# EAGLE design SolarCharger_RevE (EAGLE 7.6.0)

## Sheet 1 of 5
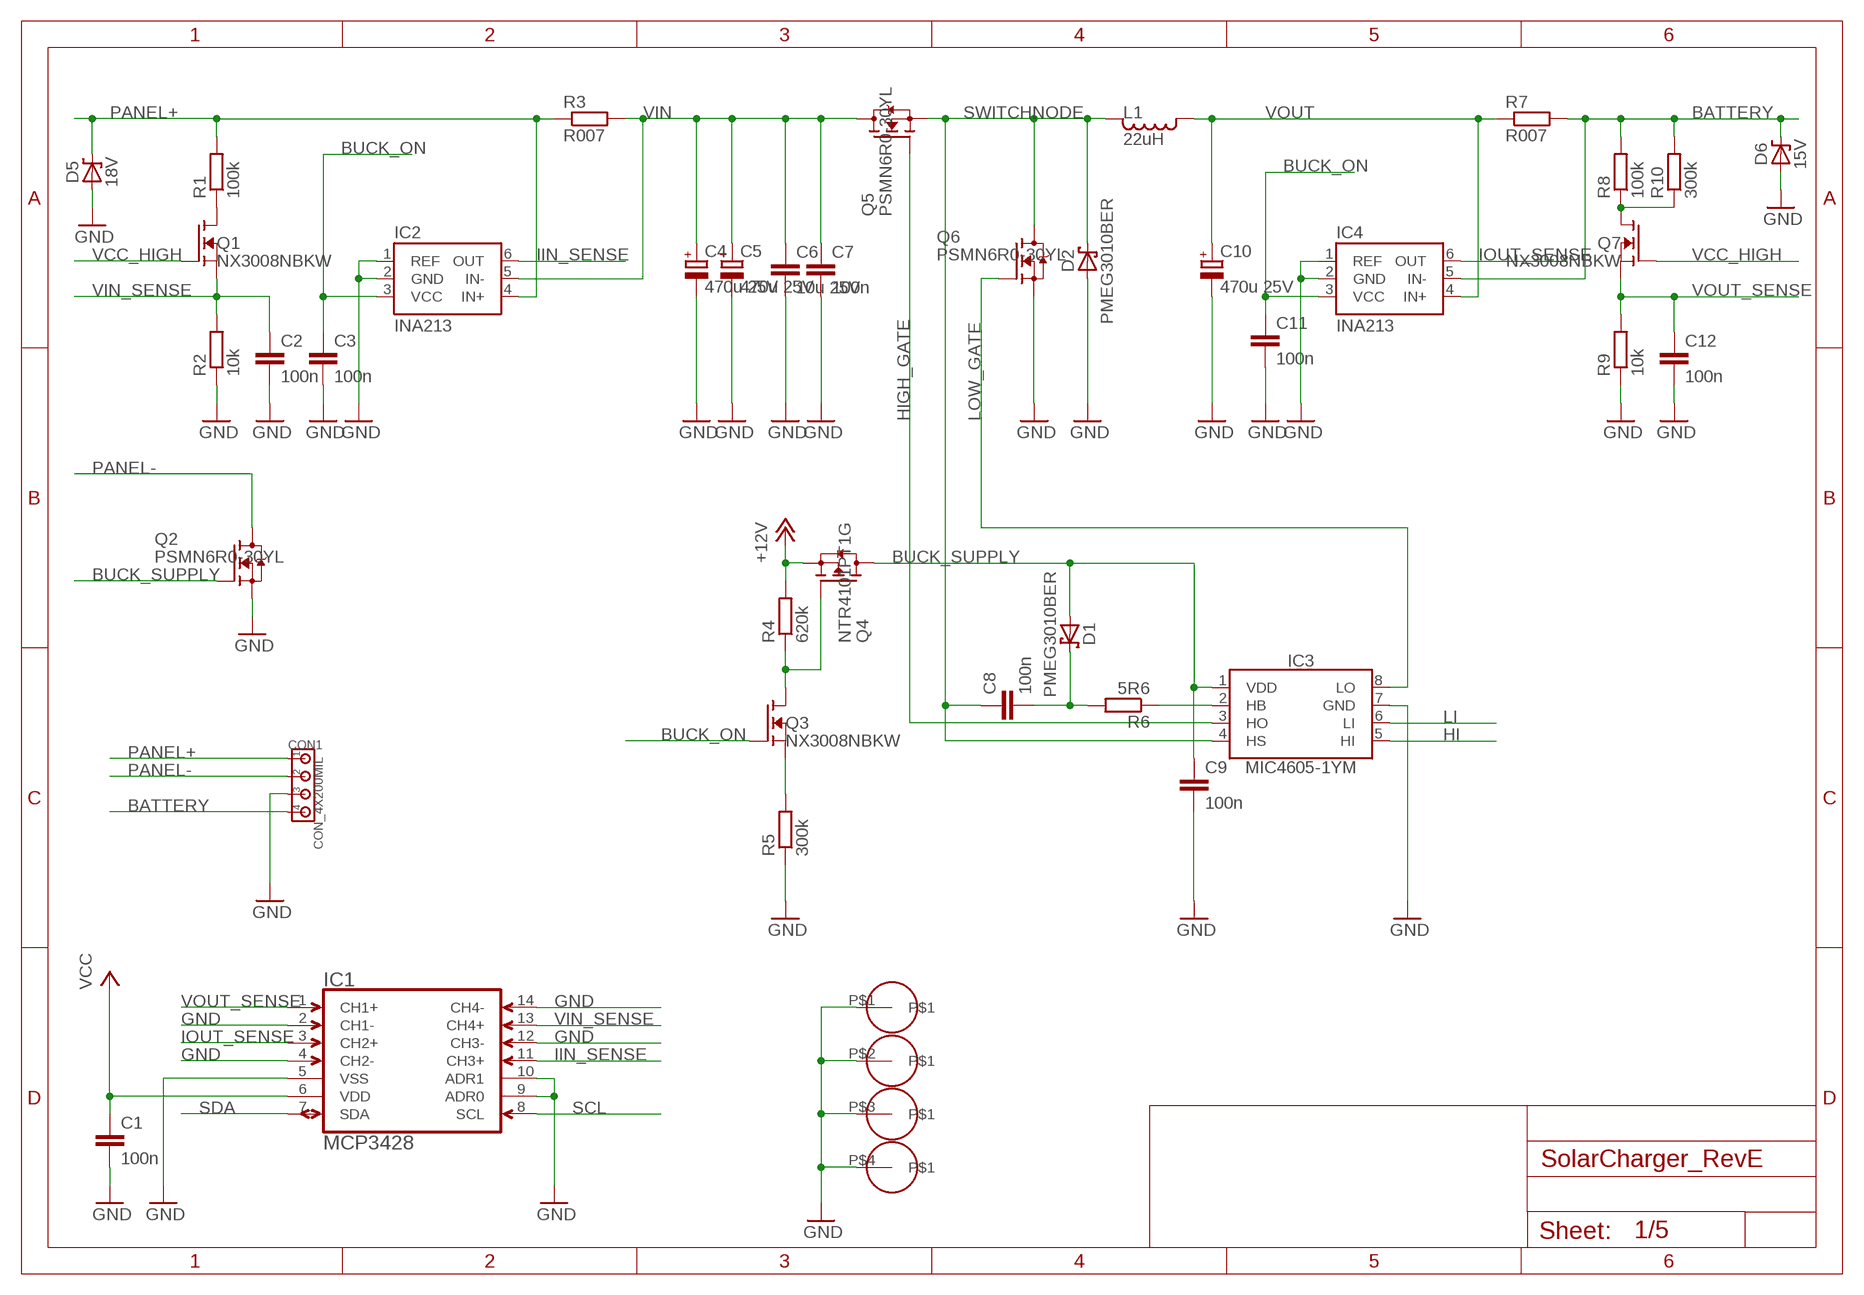
[diagram p0: schematic, sheet 1]

### Parts
C1  100n  CC0805  [C0805]
C2  100n  CC0805  [C0805]
C3  100n  CC0805  [C0805]
C4  470u 25V  C_POLARIZED10MM  [10MM]
C5  470u 25V  C_POLARIZED10MM  [10MM]
C6  10u 25V  CC1206  [C1206]
C7  100n  CC0805  [C0805]
C8  100n  CC0805  [C0805]
C9  100n  CC0805  [C0805]
C10  470u 25V  C_POLARIZED10MM  [10MM]
C11  100n  CC0805  [C0805]
C12  100n  CC0805  [C0805]
CON1  CON_4X200MIL  [200MIL_4X]
D1  PMEG3010BER  SCHOTTKYSOD123  [SOD123]
D2  PMEG3010BER  SCHOTTKYSOD123  [SOD123]
D5  18V  ZENERDO214  [DO214AC]
D6  15V  ZENERDO214  [DO214AC]
DRL1  PCB_115_90  [PCB_115_90]
IC1  MCP3428  [SO14]
IC2  INA213  INA21  [SC70-6]
IC3  MIC4605-1YM  MIC4605  [SOIC8]
IC4  INA213  INA21  [SC70-6]
L1  22uH  INDUCTORMSS1210  [MSS1210]
Q1  NX3008NBKW  N-FETSOT23  [SOT23]
Q2  PSMN6R0-30YL  N-PWR-MOSFETLFPAK  [LFPAK]
Q3  NX3008NBKW  N-FETSOT23  [SOT23]
Q4  NTR4101PT1G  P-FETSOT23  [SOT23]
Q5  PSMN6R0-30YL  N-PWR-MOSFETLFPAK  [LFPAK]
Q6  PSMN6R0-30YL  N-PWR-MOSFETLFPAK  [LFPAK]
Q7  NX3008NBKW  N-FETSOT23  [SOT23]
R1  100k  RESISTORR0805  [R0805]
R2  10k  RESISTORR0805  [R0805]
R3  R007  RESISTORR1206  [R1206]
R4  620k  RESISTORR0805  [R0805]
R5  300k  RESISTORR0805  [R0805]
R6  5R6  RESISTORR0805  [R0805]
R7  R007  RESISTORR1206  [R1206]
R8  100k  RESISTORR0805  [R0805]
R9  10k  RESISTORR0805  [R0805]
R10  300k  RESISTORR0805  [R0805]

### Nets
BATTERY [high_voltage]: CON1.4 D6.C IC4.5(IN-) R7.2 R8.2 R10.2 ; also sheet 2,4,5
BUCK_ON: C3.1 C11.1 IC2.3(VCC) IC4.3(VCC) Q3.1(G) ; also sheet 2
BUCK_SUPPLY [high_voltage]: C9.1 D1.A IC3.1(VDD) Q2.4(G) Q4.3(D)
GND: C1.2 C2.2 C3.2 C4.- C5.- C6.2 C7.2 C9.2 C10.- C11.2 C12.2 CON1.3 D2.A D5.A D6.A DRL1.P$1 DRL1.P$2 DRL1.P$3 DRL1.P$4 IC1.2(CH1-) IC1.4(CH2-) IC1.5(VSS) IC1.9(ADR0) IC1.10(ADR1) IC1.12(CH3-) IC1.14(CH4-) IC2.1(REF) IC2.2(GND) IC3.7(GND) IC4.1(REF) IC4.2(GND) Q2.1(S) Q2.2(S) Q2.3(S) Q6.1(S) Q6.2(S) Q6.3(S) R2.1 R5.1 R9.1 ; also sheet 2,3,4,5
HI: IC3.5(HI) ; also sheet 2
HIGH_GATE: IC3.3(HO) Q5.4(G)
IIN_SENSE: IC1.11(CH3+) IC2.6(OUT)
IOUT_SENSE: IC1.3(CH2+) IC4.6(OUT)
LI: IC3.6(LI) ; also sheet 2
LOW_GATE [high_voltage]: IC3.8(LO) Q6.4(G)
N$1: C8.2 D1.C R6.2
N$6: Q1.3(D) R1.1
N$8: IC3.2(HB) R6.1
N$16: Q3.3(D) Q4.1(G) R4.1
N$17: Q7.3(D) R8.1 R10.1
N$19: Q3.2(S) R5.2
PANEL+ [high_voltage]: CON1.1 D5.C IC2.4(IN+) R1.2 R3.1
PANEL-: CON1.2 Q2.MB1(D) Q2.MB2(D) Q2.MB3(D) Q2.VIA1(D) Q2.VIA2(D) Q2.VIA3(D) Q2.VIA4(D) Q2.VIA5(D) Q2.VIA6(D) Q2.VIA7(D) Q2.VIA8(D) Q2.VIA9(D)
SCL: IC1.8(SCL) ; also sheet 2,3
SDA: IC1.7(SDA) ; also sheet 2,3
SWITCHNODE [high_voltage]: C8.1 D2.C IC3.4(HS) L1.2 L1.2B L1.2C L1.2D L1.2E L1.2F L1.2G L1.2H Q5.1(S) Q5.2(S) Q5.3(S) Q6.MB1(D) Q6.MB2(D) Q6.MB3(D) Q6.VIA1(D) Q6.VIA2(D) Q6.VIA3(D) Q6.VIA4(D) Q6.VIA5(D) Q6.VIA6(D) Q6.VIA7(D) Q6.VIA8(D) Q6.VIA9(D)
VCC: C1.1 IC1.6(VDD) ; also sheet 2,3
VCC_HIGH: Q1.1(G) Q7.1(G) ; also sheet 2,3
VIN [high_voltage]: C4.+ C5.+ C6.1 C7.1 IC2.5(IN-) Q5.MB1(D) Q5.MB2(D) Q5.MB3(D) Q5.VIA1(D) Q5.VIA2(D) Q5.VIA3(D) Q5.VIA4(D) Q5.VIA5(D) Q5.VIA6(D) Q5.VIA7(D) Q5.VIA8(D) Q5.VIA9(D) R3.2
VIN_SENSE: C2.1 IC1.13(CH4+) Q1.2(S) R2.2
VOUT [high_voltage]: C10.+ IC4.4(IN+) L1.1 L1.1B L1.1C L1.1D L1.1E L1.1F L1.1G L1.1H Q4.2(S) R4.2 R7.1 ; supply symbol labelled +12V ; also sheet 3,5
VOUT_SENSE: C12.1 IC1.1(CH1+) Q7.2(S) R9.2

## Sheet 2 of 5
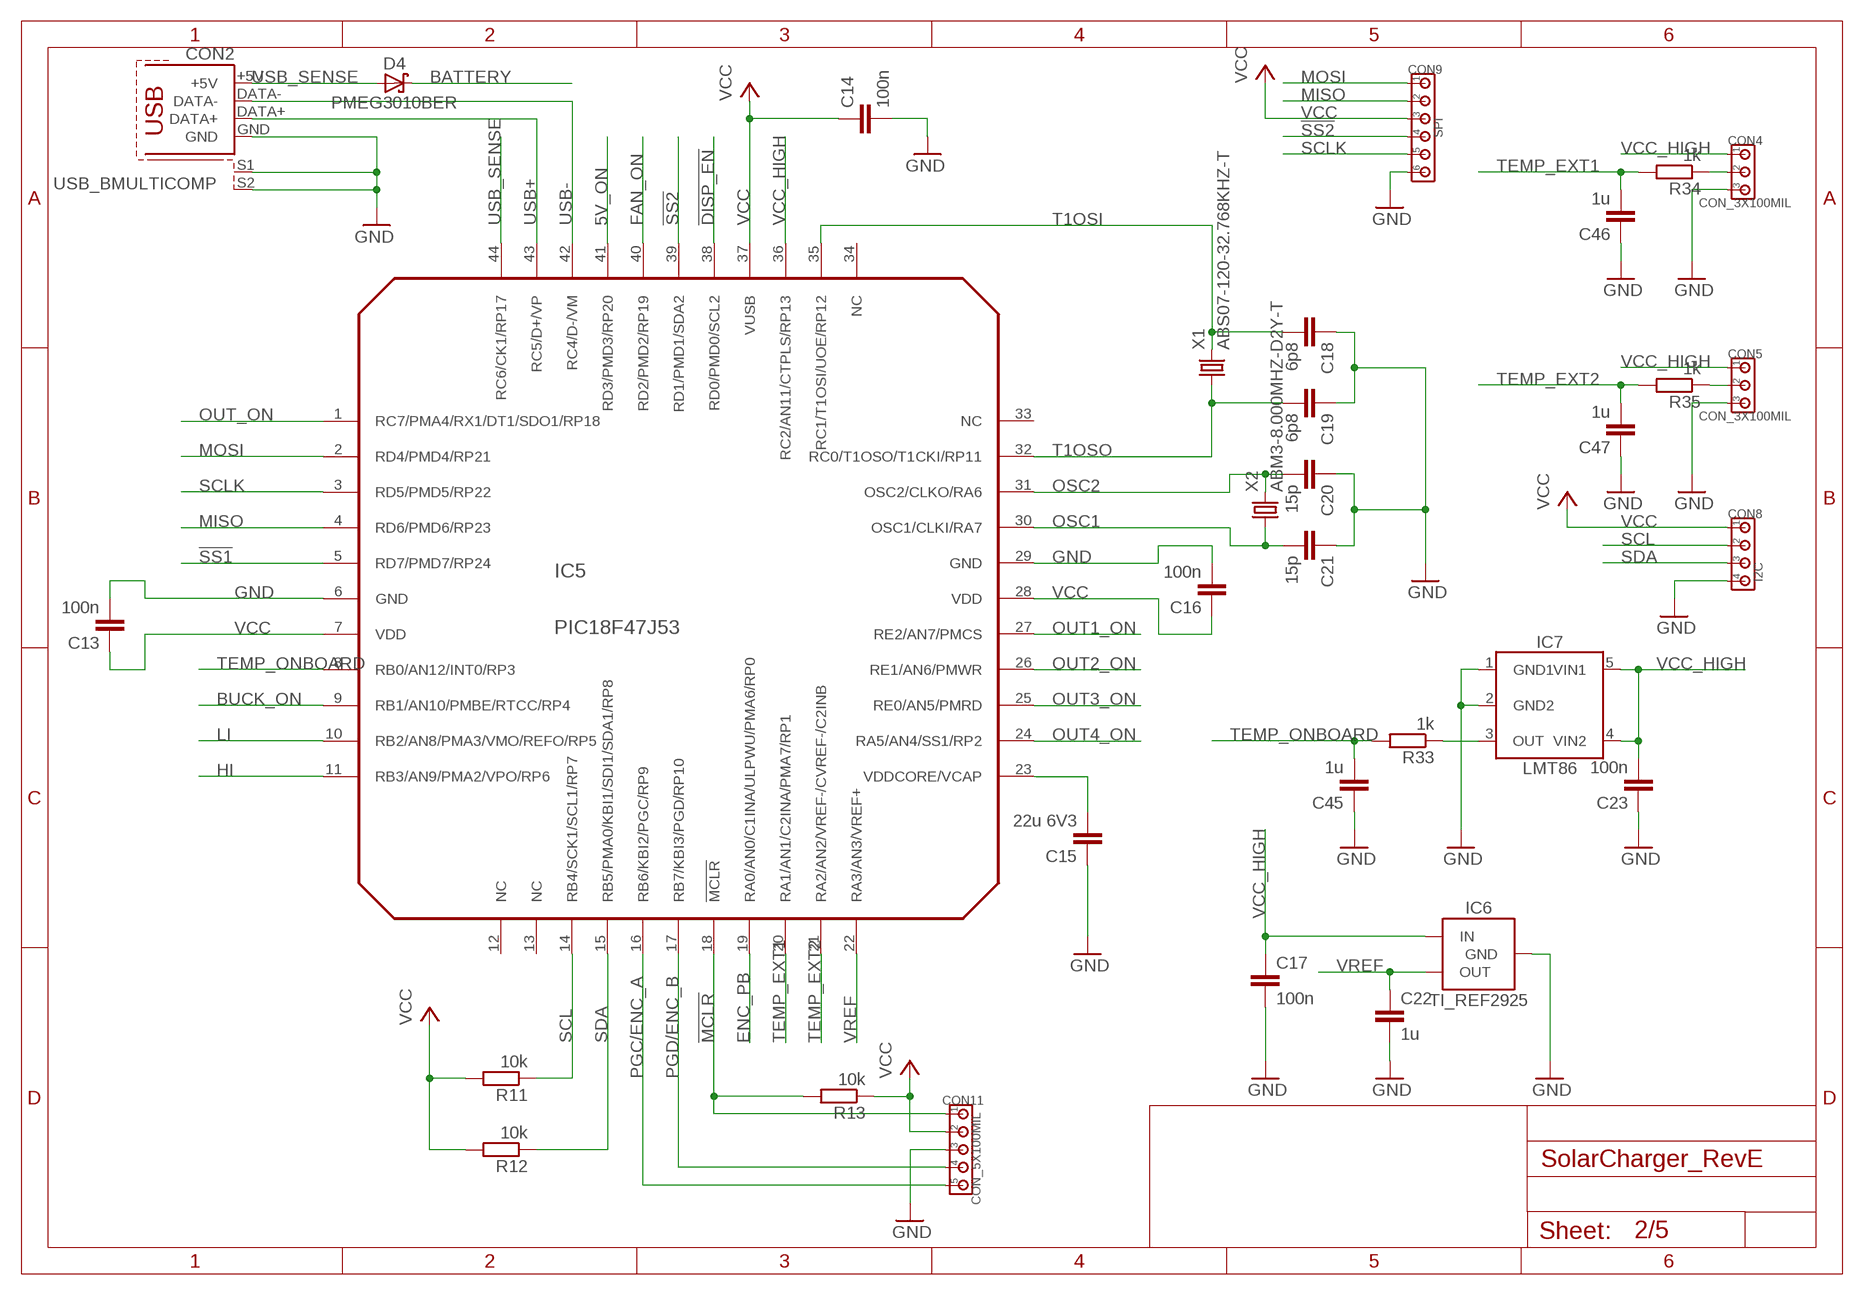
[diagram p1: schematic, sheet 2]

### Parts
C13  100n  CC0805  [C0805]
C14  100n  CC0805  [C0805]
C15  22u 6V3  CC1206  [C1206]
C16  100n  CC0805  [C0805]
C17  100n  CC0805  [C0805]
C18  6p8  CC0805  [C0805]
C19  6p8  CC0805  [C0805]
C20  15p  CC0805  [C0805]
C21  15p  CC0805  [C0805]
C22  1u  CC0805  [C0805]
C23  100n  CC0805  [C0805]
C45  1u  CC0805  [C0805]
C46  1u  CC0805  [C0805]
C47  1u  CC0805  [C0805]
CON2  USB_BMULTICOMP  [USB_B]
CON4  CON_3X100MIL  [100MIL_3X]
CON5  CON_3X100MIL  [100MIL_3X]
CON8  I2C  CON_4X100MIL  [100MIL_4X]
CON9  SPI  CON_6X3X2  [100MIL_3X2]
CON11  CON_5X100MIL  [100MIL_5X]
D4  PMEG3010BER  SCHOTTKYSOD123  [SOD123]
IC5  PIC18F47J53  PIC18F46J50  [TQFP44]
IC6  TI_REF2925  TS6001  [SOT23]
IC7  LMT86  [SC70-5]
R11  10k  RESISTORR0805  [R0805]
R12  10k  RESISTORR0805  [R0805]
R13  10k  RESISTORR0805  [R0805]
R33  1k  RESISTORR0805  [R0805]
R34  1k  RESISTORR0805  [R0805]
R35  1k  RESISTORR0805  [R0805]
X1  ABS07-120-32.768KHZ-T  CRYSTAL3.2X1.5  [3.2X1.5MM]
X2  ABM3-8.000MHZ-D2Y-T  CRYSTAL5X3.2MM  [5X3.2MM]

### Nets
5V_ON: IC5.41(RD3/PMD3/RP20) ; also sheet 4
!DISP_EN!: IC5.38(RD0/PMD0/SCL2) ; also sheet 3
!MCLR!: CON11.1 IC5.18(!MCLR!) R13.2
!SS1!: IC5.5(RD7/PMD7/RP24) ; also sheet 3
!SS2!: CON9.4 IC5.39(RD1/PMD1/SDA2)
BATTERY [high_voltage]: D4.C ; also sheet 1,4,5
BUCK_ON: IC5.9(RB1/AN10/PMBE/RTCC/RP4) ; also sheet 1
ENC_PB: IC5.19(RA0/AN0/C1INA/ULPWU/PMA6/RP0) ; also sheet 3
FAN_ON: IC5.40(RD2/PMD2/RP19) ; also sheet 5
GND: C13.2 C14.2 C15.1 C16.2 C17.2 C18.1 C19.1 C20.1 C21.1 C22.2 C23.1 C45.1 C46.1 C47.1 CON2.GND CON2.S1 CON2.S2 CON4.3 CON5.3 CON8.4 CON9.6 CON11.3 IC5.6(GND) IC5.29(GND) IC6.3(GND) IC7.1(GND1) IC7.2(GND2) ; also sheet 1,3,4,5
HI: IC5.11(RB3/AN9/PMA2/VPO/RP6) ; also sheet 1
LI: IC5.10(RB2/AN8/PMA3/VMO/REFO/RP5) ; also sheet 1
MISO: CON9.2 IC5.4(RD6/PMD6/RP23) ; also sheet 3
MOSI: CON9.1 IC5.2(RD4/PMD4/RP21) ; also sheet 3
N$2: C15.2 IC5.23(VDDCORE/VCAP)
N$4: IC7.3(OUT) R33.1
N$7: CON4.2 R34.1
N$14: CON5.2 R35.1
OSC1: C21.2 IC5.30(OSC1/CLKI/RA7) X2.1
OSC2: C20.2 IC5.31(OSC2/CLKO/RA6) X2.2
OUT1_ON: IC5.27(RE2/AN7/PMCS) ; also sheet 5
OUT2_ON: IC5.26(RE1/AN6/PMWR) ; also sheet 5
OUT3_ON: IC5.25(RE0/AN5/PMRD) ; also sheet 5
OUT4_ON: IC5.24(RA5/AN4/SS1/RP2) ; also sheet 5
OUT_ON: IC5.1(RC7/PMA4/RX1/DT1/SDO1/RP18) ; also sheet 5
PGC/ENC_A: CON11.5 IC5.16(RB6/KBI2/PGC/RP9) ; also sheet 3
PGD/ENC_B: CON11.4 IC5.17(RB7/KBI3/PGD/RP10) ; also sheet 3
SCL: CON8.2 IC5.14(RB4/SCK1/SCL1/RP7) R11.1 ; also sheet 1,3
SCLK: CON9.5 IC5.3(RD5/PMD5/RP22) ; also sheet 3
SDA: CON8.3 IC5.15(RB5/PMA0/KBI1/SDI1/SDA1/RP8) R12.1 ; also sheet 1,3
T1OSI: C18.2 IC5.35(RC1/T1OSI/UOE/RP12) X1.2
T1OSO: C19.2 IC5.32(RC0/T1OSO/T1CKI/RP11) X1.1
TEMP_EXT1: C46.2 IC5.20(RA1/AN1/C2INA/PMA7/RP1) R34.2
TEMP_EXT2: C47.2 IC5.21(RA2/AN2/VREF-/CVREF-/C2INB) R35.2
TEMP_ONBOARD: C45.2 IC5.8(RB0/AN12/INT0/RP3) R33.2
USB+: CON2.DATA+ IC5.43(RC5/D+/VP)
USB-: CON2.DATA- IC5.42(RC4/D-/VM)
USB_SENSE: CON2.+5V D4.A IC5.44(RC6/CK1/RP17)
VCC: C13.1 C14.1 C16.1 CON8.1 CON9.3 CON11.2 IC5.7(VDD) IC5.28(VDD) IC5.37(VUSB) R11.2 R12.2 R13.1 ; also sheet 1,3
VCC_HIGH: C17.1 C23.2 CON4.1 CON5.1 IC5.36(RC2/AN11/CTPLS/RP13) IC6.1(IN) IC7.4(VIN2) IC7.5(VIN1) ; also sheet 1,3
VREF: C22.1 IC5.22(RA3/AN3/VREF+) IC6.2(OUT)
Unconnected: IC5.12(NC) IC5.13(NC) IC5.33(NC) IC5.34(NC)

## Sheet 3 of 5
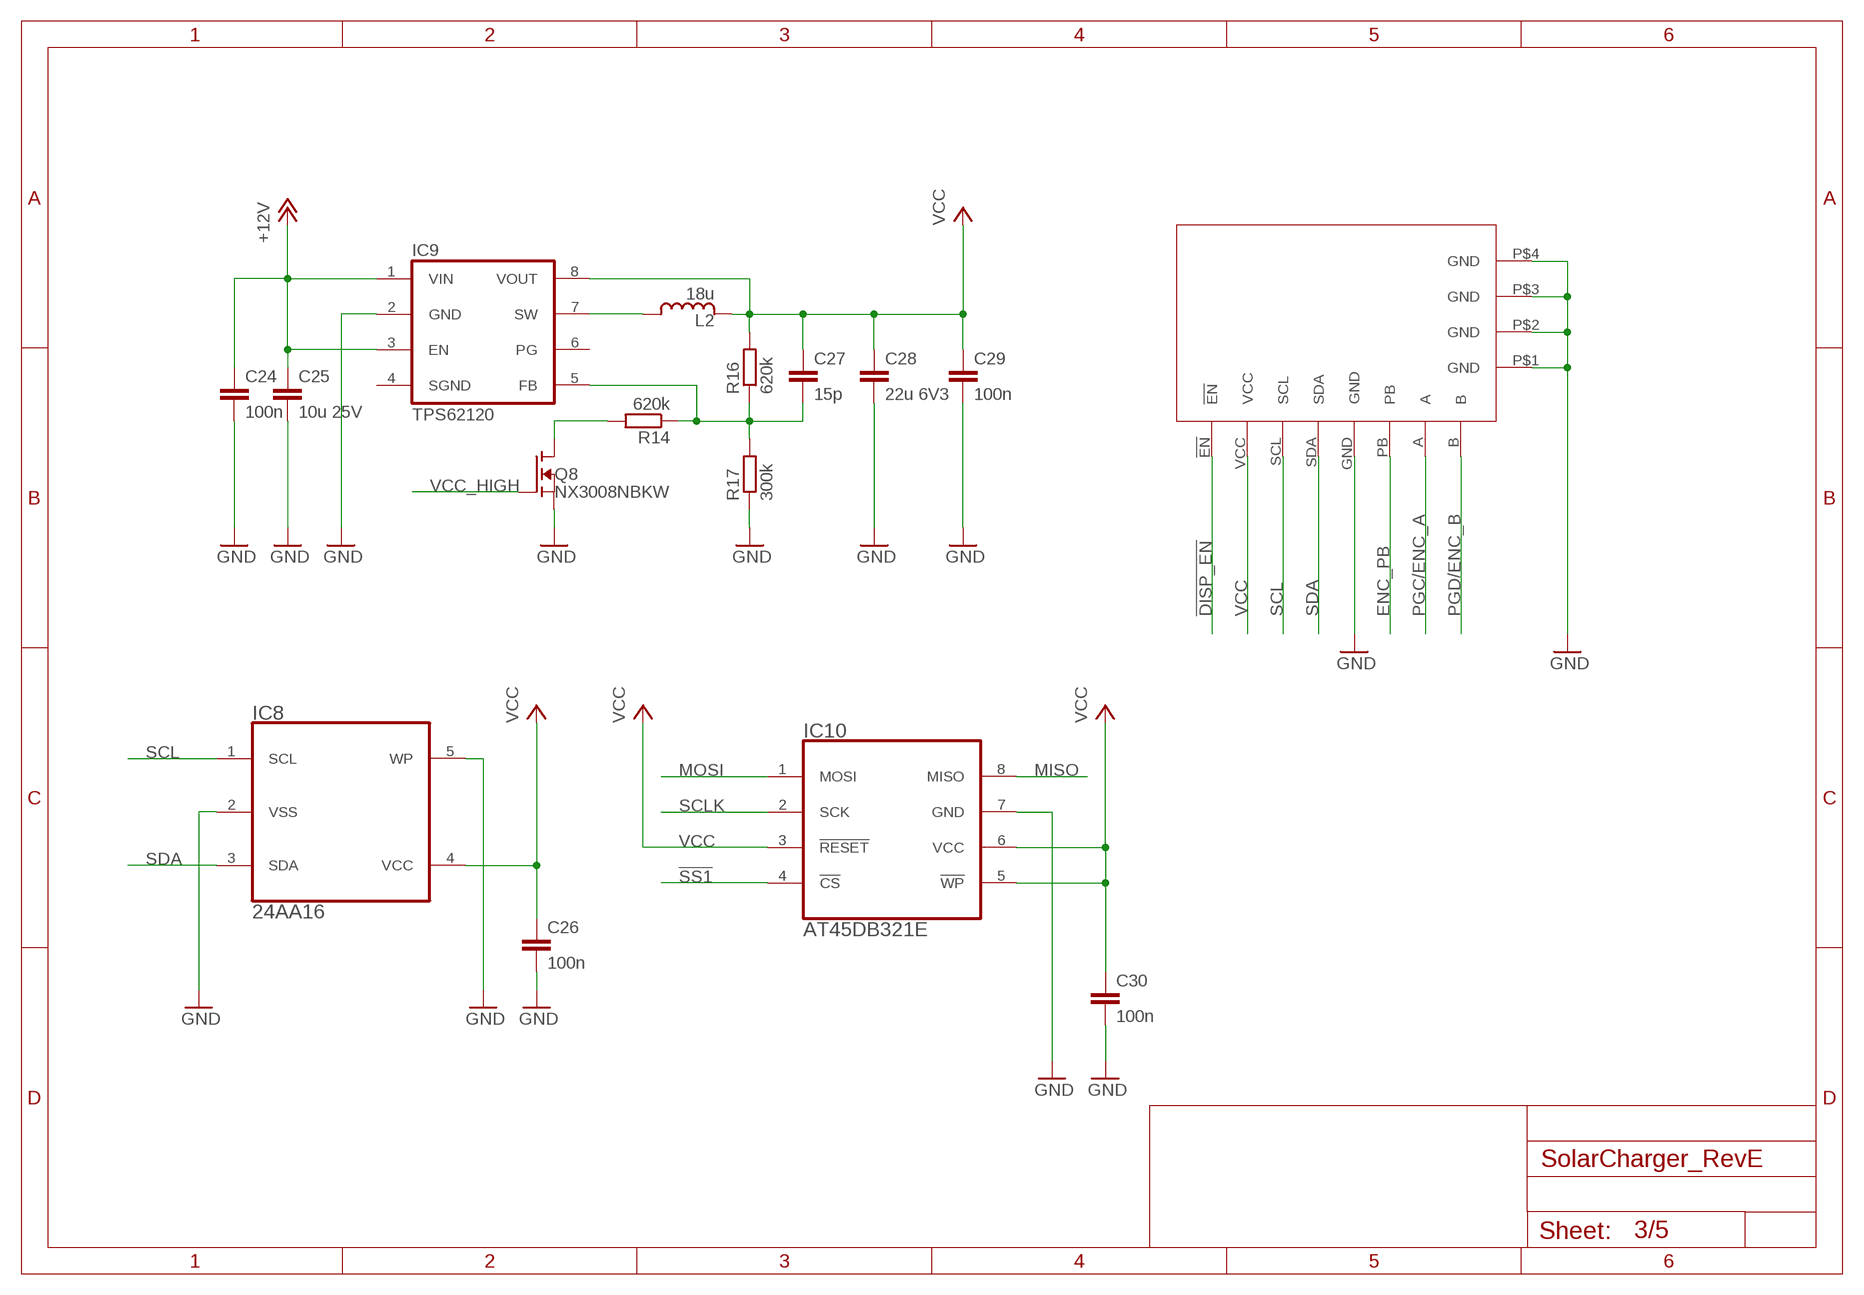
[diagram p2: schematic, sheet 3]

### Parts
BRD1  DISPLAY_UNIT  [DISPLAY_UNIT]
C24  100n  CC0805  [C0805]
C25  10u 25V  CC1206  [C1206]
C26  100n  CC0805  [C0805]
C27  15p  CC0805  [C0805]
C28  22u 6V3  CC1206  [C1206]
C29  100n  CC0805  [C0805]
C30  100n  CC0805  [C0805]
IC8  24AA16  [SOT-23-5]
IC9  TPS62120  [SOT-23-8]
IC10  AT45DB321E  AT45DB161EEIAJ  [EIAJ_SOIC8]
L2  18u  INDUCTORLPS3015  [LPS3015]
Q8  NX3008NBKW  N-FETSOT23  [SOT23]
R14  620k  RESISTORR0805  [R0805]
R16  620k  RESISTORR0805  [R0805]
R17  300k  RESISTORR0805  [R0805]

### Nets
!DISP_EN!: BRD1.!EN! ; also sheet 2
!SS1!: IC10.4(!CS!) ; also sheet 2
ENC_PB: BRD1.PB ; also sheet 2
GND: BRD1.GND BRD1.P$1(GND) BRD1.P$2(GND) BRD1.P$3(GND) BRD1.P$4(GND) C24.2 C25.2 C26.2 C28.2 C29.2 C30.2 IC8.2(VSS) IC8.5(WP) IC9.2(GND) IC10.7(GND) Q8.2(S) R17.1 ; also sheet 1,2,4,5
MISO: IC10.8(MISO) ; also sheet 2
MOSI: IC10.1(MOSI) ; also sheet 2
N$5: Q8.3(D) R14.2
N$9: IC9.7(SW) L2.1 L2.1B L2.1C L2.1D L2.1E
N$11: C27.2 IC9.5(FB) R14.1 R16.1 R17.2
PGC/ENC_A: BRD1.A ; also sheet 2
PGD/ENC_B: BRD1.B ; also sheet 2
SCL: BRD1.SCL IC8.1(SCL) ; also sheet 1,2
SCLK: IC10.2(SCK) ; also sheet 2
SDA: BRD1.SDA IC8.3(SDA) ; also sheet 1,2
VCC: BRD1.VCC C26.1 C27.1 C28.1 C29.1 C30.1 IC8.4(VCC) IC9.8(VOUT) IC10.3(!RESET!) IC10.5(!WP!) IC10.6(VCC) L2.2 L2.2B L2.2C L2.2D L2.2E R16.2 ; also sheet 1,2
VCC_HIGH: Q8.1(G) ; also sheet 1,2
VOUT [high_voltage]: C24.1 C25.1 IC9.1(VIN) IC9.3(EN) ; supply symbol labelled +12V ; also sheet 1,5
Unconnected: IC9.4(SGND) IC9.6(PG)

## Sheet 4 of 5
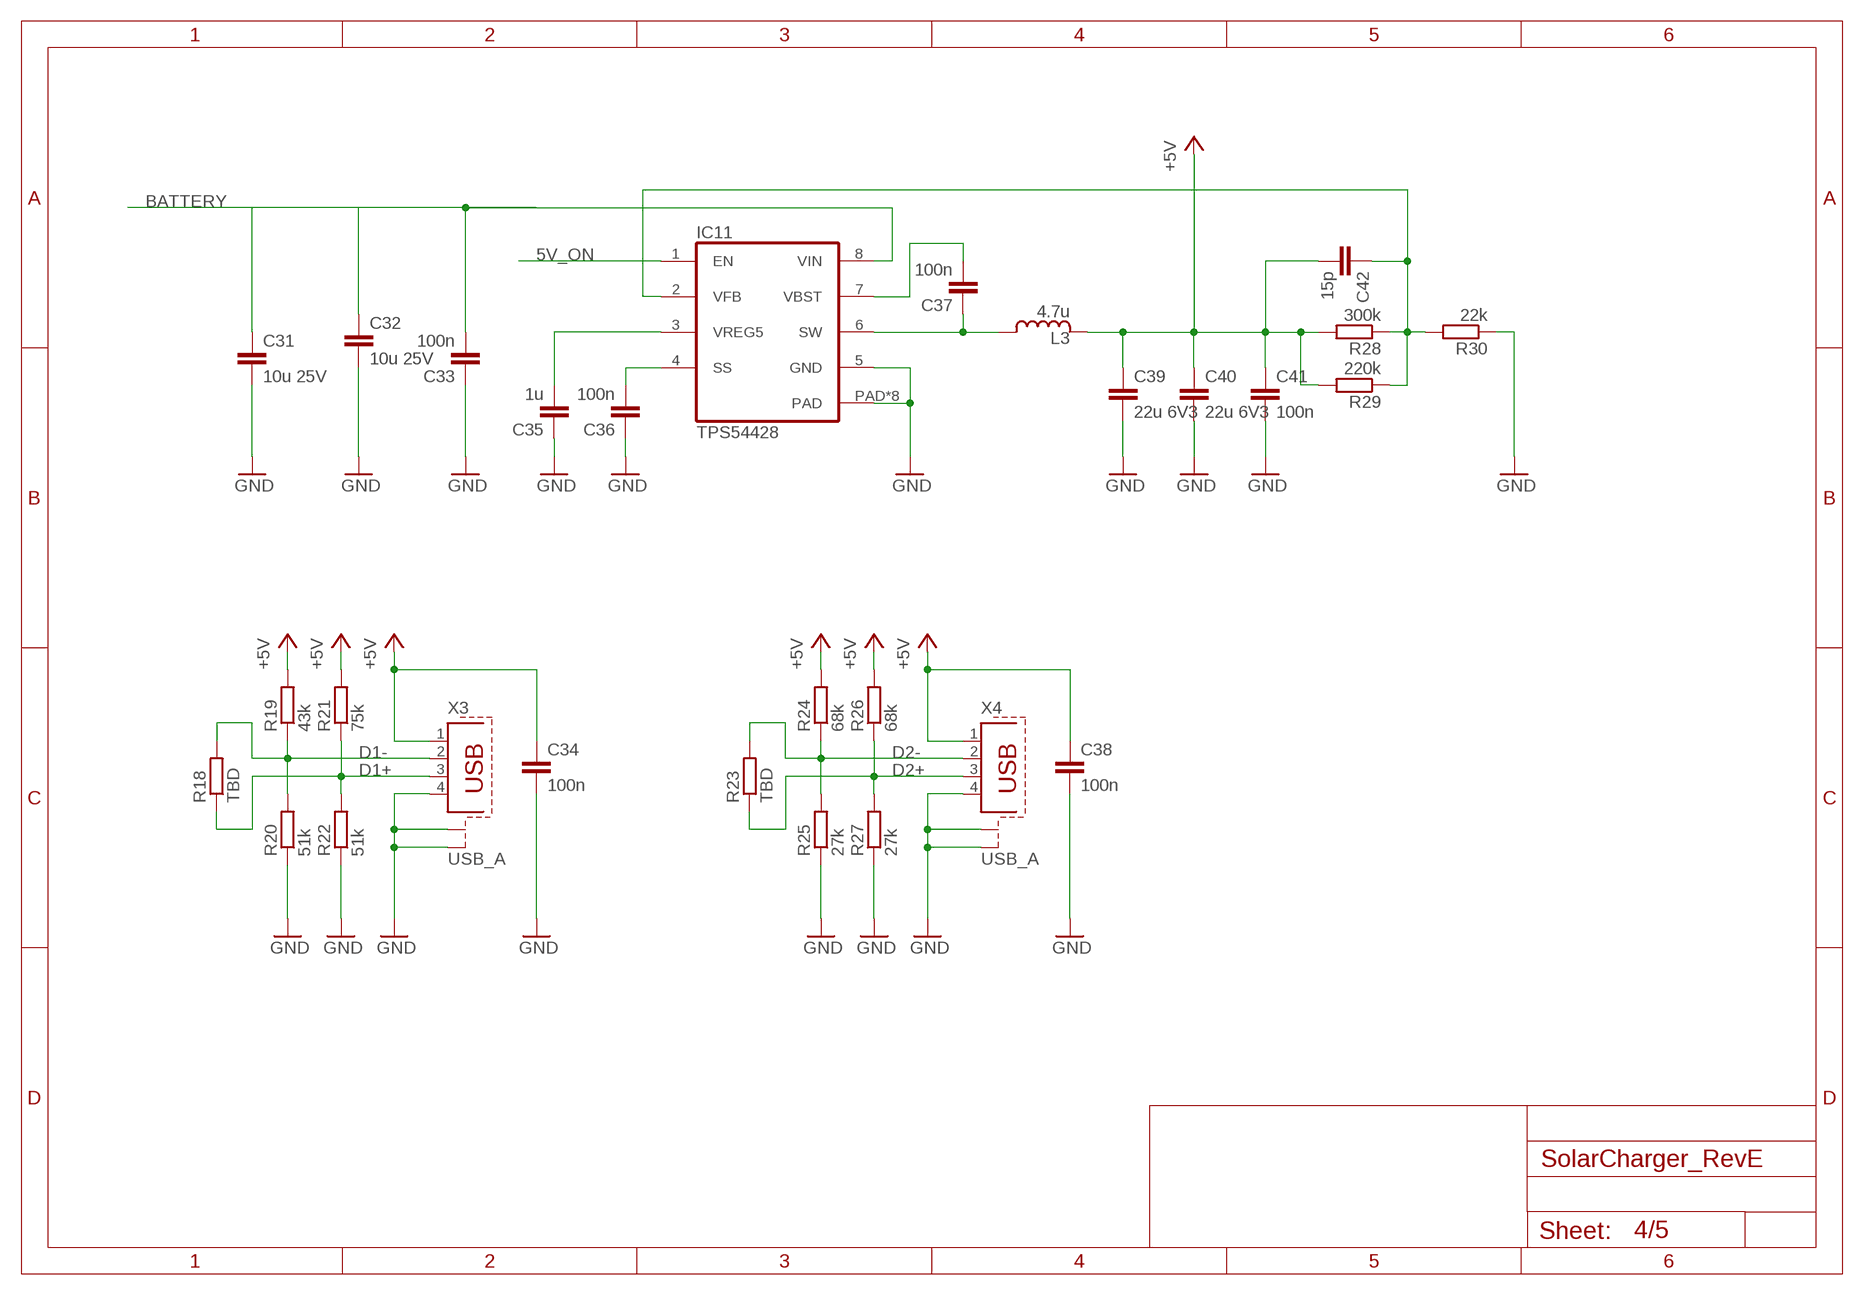
[diagram p3: schematic, sheet 4]

### Parts
C31  10u 25V  CC1206  [C1206]
C32  10u 25V  CC1206  [C1206]
C33  100n  CC0805  [C0805]
C34  100n  CC0805  [C0805]
C35  1u  CC0805  [C0805]
C36  100n  CC0805  [C0805]
C37  100n  CC0805  [C0805]
C38  100n  CC0805  [C0805]
C39  22u 6V3  CC1206  [C1206]
C40  22u 6V3  CC1206  [C1206]
C41  100n  CC0805  [C0805]
C42  15p  CC0805  [C0805]
IC11  TPS54428  [SOIC8_PWRPAD]
L3  4.7u  INDUCTORMSS1038  [MSS1038]
R18  TBD  RESISTORR0805  [R0805]
R19  43k  RESISTORR0805  [R0805]
R20  51k  RESISTORR0805  [R0805]
R21  75k  RESISTORR0805  [R0805]
R22  51k  RESISTORR0805  [R0805]
R23  TBD  RESISTORR0805  [R0805]
R24  68k  RESISTORR0805  [R0805]
R25  27k  RESISTORR0805  [R0805]
R26  68k  RESISTORR0805  [R0805]
R27  27k  RESISTORR0805  [R0805]
R28  300k  RESISTORR0805  [R0805]
R29  220k  RESISTORR0805  [R0805]
R30  22k  RESISTORR0805  [R0805]
X3  USB_A  [USB_A]
X4  USB_A  [USB_A]

### Nets
5V_ON: IC11.1(EN) ; also sheet 2
+5V: C34.1 C38.1 C39.1 C40.1 C41.1 C42.2 L3.2 L3.2B L3.2C L3.2D L3.2E R19.2 R21.2 R24.2 R26.2 R28.2 R29.2 X3.1 X4.1
BATTERY [high_voltage]: C31.1 C32.1 C33.2 IC11.8(VIN) ; also sheet 1,2,5
D1+: R18.1 R21.1 R22.2 X3.3
D1-: R18.2 R19.1 R20.2 X3.2
D2+: R23.1 R26.1 R27.2 X4.3
D2-: R23.2 R24.1 R25.2 X4.2
GND: C31.2 C32.2 C33.1 C34.2 C35.1 C36.1 C38.2 C39.2 C40.2 C41.2 IC11.5(GND) IC11.PAD IC11.PAD_BOTTOM(PAD) IC11.VIA1(PAD) IC11.VIA2(PAD) IC11.VIA3(PAD) IC11.VIA4(PAD) IC11.VIA5(PAD) IC11.VIA6(PAD) R20.1 R22.1 R25.1 R27.1 R30.1 X3.4 X3.S1 X3.S2 X4.4 X4.S1 X4.S2 ; also sheet 1,2,3,5
N$12: C37.2 IC11.7(VBST)
N$13: C37.1 IC11.6(SW) L3.1 L3.1B L3.1C L3.1D L3.1E
N$15: C35.2 IC11.3(VREG5)
N$20: C36.2 IC11.4(SS)
N$22: C42.1 IC11.2(VFB) R28.1 R29.1 R30.2

## Sheet 5 of 5
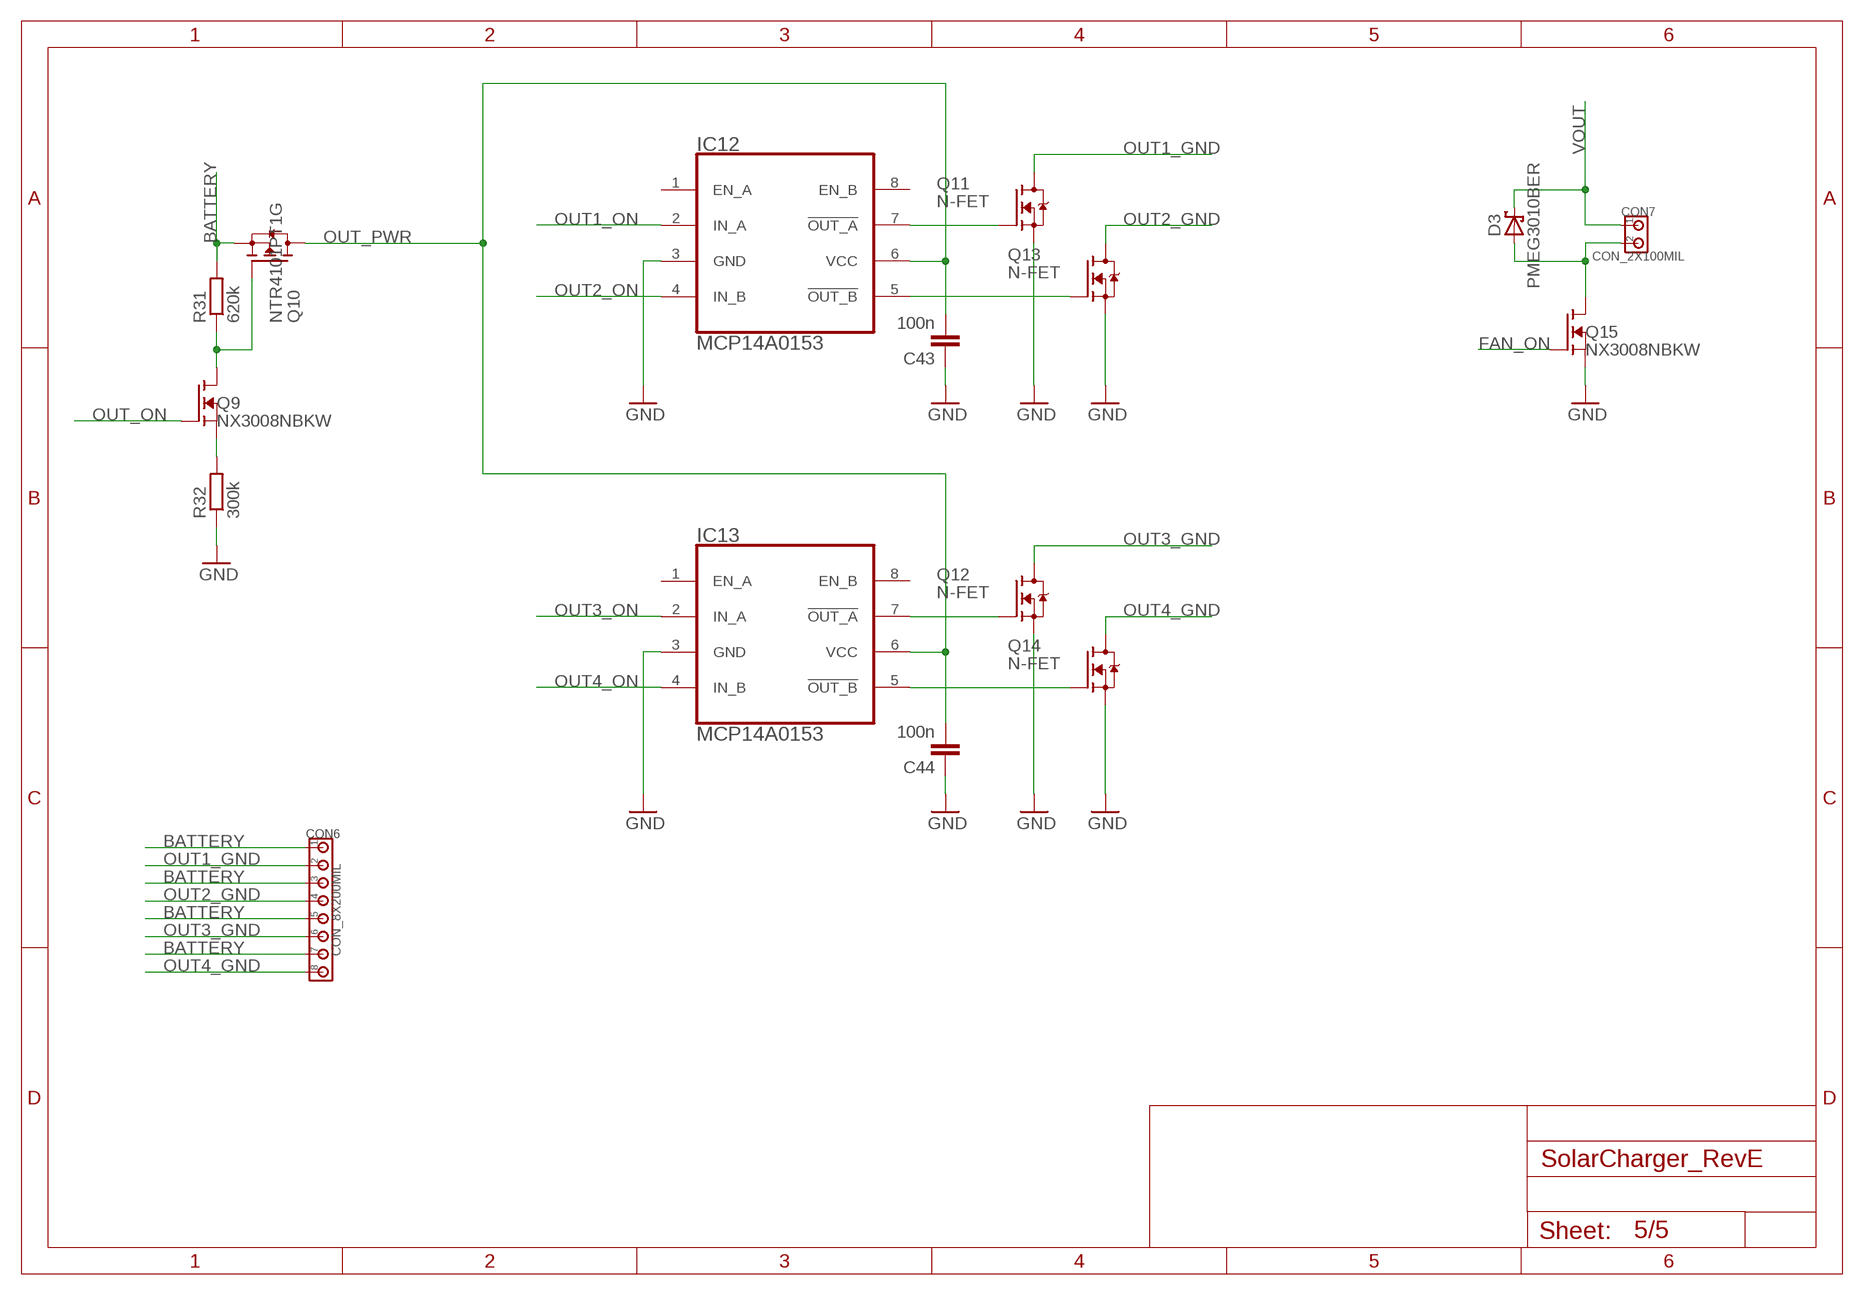
[diagram p4: schematic, sheet 5]

### Parts
C43  100n  CC0805  [C0805]
C44  100n  CC0805  [C0805]
CON6  CON_8X200MIL  [200MIL_8X]
CON7  CON_2X100MIL  [100MIL_2X]
D3  PMEG3010BER  SCHOTTKYSOD123  [SOD123]
IC12  MCP14A0153  [SSOP8]
IC13  MCP14A0153  [SSOP8]
Q9  NX3008NBKW  N-FETSOT23  [SOT23]
Q10  NTR4101PT1G  P-FETSOT23  [SOT23]
Q11  N-FET  N-PWR-MOSFETLFPAK  [LFPAK]
Q12  N-FET  N-PWR-MOSFETLFPAK  [LFPAK]
Q13  N-FET  N-PWR-MOSFETLFPAK  [LFPAK]
Q14  N-FET  N-PWR-MOSFETLFPAK  [LFPAK]
Q15  NX3008NBKW  N-FETSOT23  [SOT23]
R31  620k  RESISTORR0805  [R0805]
R32  300k  RESISTORR0805  [R0805]

### Nets
BATTERY [high_voltage]: CON6.1 CON6.3 CON6.5 CON6.7 Q10.2(S) R31.2 ; also sheet 1,2,4
FAN_ON: Q15.1(G) ; also sheet 2
GND: C43.1 C44.1 IC12.3(GND) IC13.3(GND) Q11.1(S) Q11.2(S) Q11.3(S) Q12.1(S) Q12.2(S) Q12.3(S) Q13.1(S) Q13.2(S) Q13.3(S) Q14.1(S) Q14.2(S) Q14.3(S) Q15.2(S) R32.1 ; also sheet 1,2,3,4
N$3: Q9.3(D) Q10.1(G) R31.1
N$10: CON7.2 D3.A Q15.3(D)
N$24: IC12.7(!OUT_A!) Q11.4(G)
N$28: IC13.5(!OUT_B!) Q14.4(G)
N$31: IC13.7(!OUT_A!) Q12.4(G)
N$33: IC12.5(!OUT_B!) Q13.4(G)
N$34: Q9.2(S) R32.2
OUT1_GND: CON6.2 Q11.MB1(D) Q11.MB2(D) Q11.MB3(D) Q11.VIA1(D) Q11.VIA2(D) Q11.VIA3(D) Q11.VIA4(D) Q11.VIA5(D) Q11.VIA6(D) Q11.VIA7(D) Q11.VIA8(D) Q11.VIA9(D)
OUT1_ON: IC12.2(IN_A) ; also sheet 2
OUT2_GND: CON6.4 Q13.MB1(D) Q13.MB2(D) Q13.MB3(D) Q13.VIA1(D) Q13.VIA2(D) Q13.VIA3(D) Q13.VIA4(D) Q13.VIA5(D) Q13.VIA6(D) Q13.VIA7(D) Q13.VIA8(D) Q13.VIA9(D)
OUT2_ON: IC12.4(IN_B) ; also sheet 2
OUT3_GND: CON6.6 Q12.MB1(D) Q12.MB2(D) Q12.MB3(D) Q12.VIA1(D) Q12.VIA2(D) Q12.VIA3(D) Q12.VIA4(D) Q12.VIA5(D) Q12.VIA6(D) Q12.VIA7(D) Q12.VIA8(D) Q12.VIA9(D)
OUT3_ON: IC13.2(IN_A) ; also sheet 2
OUT4_GND: CON6.8 Q14.MB1(D) Q14.MB2(D) Q14.MB3(D) Q14.VIA1(D) Q14.VIA2(D) Q14.VIA3(D) Q14.VIA4(D) Q14.VIA5(D) Q14.VIA6(D) Q14.VIA7(D) Q14.VIA8(D) Q14.VIA9(D)
OUT4_ON: IC13.4(IN_B) ; also sheet 2
OUT_ON: Q9.1(G) ; also sheet 2
OUT_PWR: C43.2 C44.2 IC12.6(VCC) IC13.6(VCC) Q10.3(D)
VOUT [high_voltage]: CON7.1 D3.C ; also sheet 1,3
Unconnected: IC12.1(EN_A) IC12.8(EN_B) IC13.1(EN_A) IC13.8(EN_B)

## Library data of the parts
BRD1 = 00Drill:DISPLAY_UNIT: Display Unit
C1-C3 C6-C9 C11-C47 = 00Capacitor:C: Capacitor
C4 C5 C10 = 00Capacitor:C_POLARIZED
CON1 CON8 = 00Connector:CON_4X: 4-pin header
CON2 = 00Connector:USB_B: Type B USB connector
CON4 CON5 = 00Connector:CON_3X: 3-pin header
CON6 = 00Connector:CON_8X: 8-pin header
CON7 = 00Connector:CON_2X: 2-pin header
CON9 = 00Connector:CON_6X: 6-pin header
CON11 = 00Connector:CON_5X: 5-pin header
D1-D4 = 00Diode:SCHOTTKY
D5 D6 = 00Diode:ZENER
DRL1 = 00Drill:PCB_115_90
IC1 = 00ADC:MCP3428: 16-Bit, 4-Channel ΔΣ Analog-to-Digital Converter with I2C™ Interface and On-Board Reference
IC2 IC4 = 00Sensor:INA21*: Current-Shunt Monitors Voltage Output, Low- or High-Side Measurement, Bidirectional, Zero-Drift Series
IC3 = 00Logic:MIC4605: 85V Half-Bridge MOSFET Driver with adaptive Dead Time
IC5 = 00PIC:PIC18F46J50: Low-power 8bit microcontroller with USB
IC6 = 00VoltageReference:TS6001: 2.5V Voltage Reference in SOT23
IC7 = 00Sensor:LMT86: Analog Temperature Sensors with Class-AB Output
IC8 = 00Logic:24AA16: 16K I2C Serial EEPROM
IC9 = 00VoltageRegulator:TPS62120: 15V, 75mA, 800kHz High Efficient Buck Converter
IC10 = 00Logic:AT45DB161E: 16-Mbit DataFlash
IC11 = 00VoltageRegulator:TPS54428: 4.5V to 18V Input, 4-A Synchronous Step-Down Converter with Eco-mode
IC12 IC13 = 00Logic:MCP14A0153: 1.5A Dual MOSFET Driver with Low Threshold Input And Enable
L1-L3 = 00Inductor:INDUCTOR
Q1 Q3 Q7-Q9 Q15 = 00Mosfet:N-FET: N-Channel MOSFET
Q2 Q5 Q6 Q11-Q14 = 00Mosfet:N-PWR-MOSFET
Q4 Q10 = 00Mosfet:P-FET
R1-R14 R16-R35 = 00Resistor:RESISTOR: RESISTOR, European symbol
X1 X2 = 00Crystal:CRYSTAL: Crystal
X3 X4 = 00Connector:USB_A

## Net classes
1 high_voltage: clearance 0.178 mm

## Board
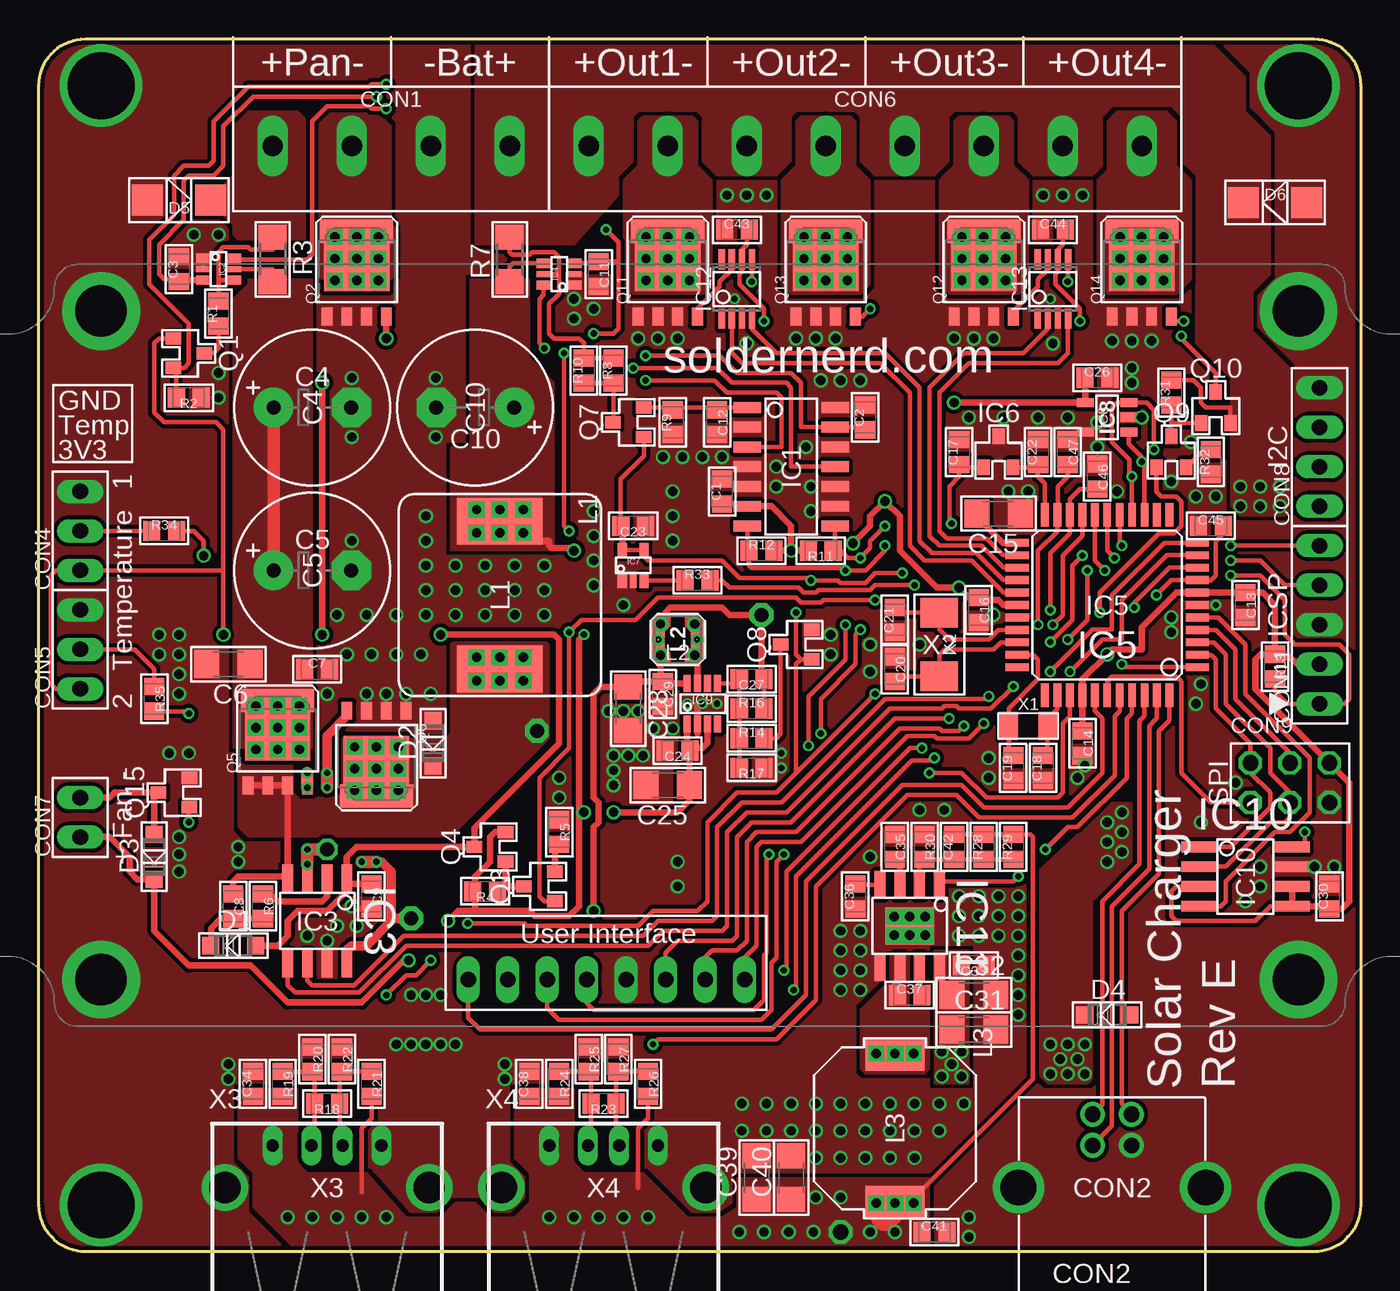
[diagram p5: board, top side]
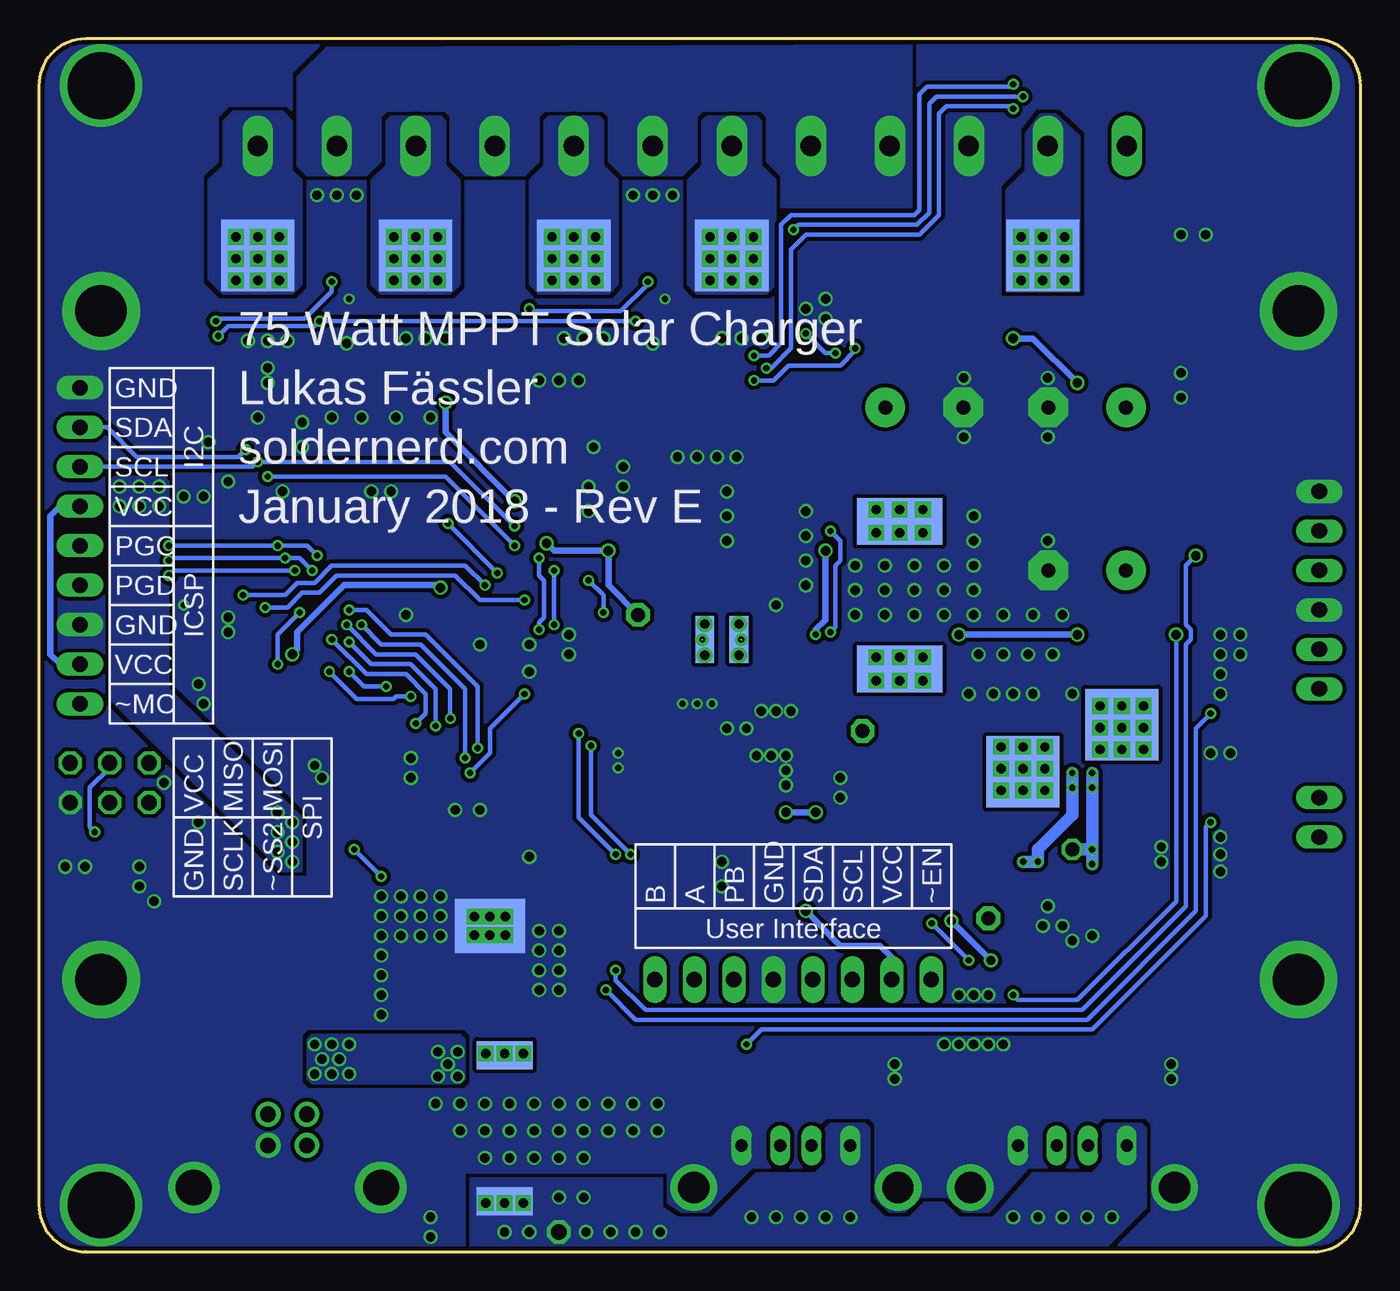
[diagram p6: board, bottom side, seen from below]

Size 85 x 78 mm. Coordinates in mm from the lower left corner, seen from the top.
Copper layers (1*16): Top 0.035mm / dielectric 1.5mm / Bottom 0.035mm
Design rules "dirt_cheap_dirty_boards.6mil *": minimum track width 6mil, minimum drill 12mil, track to track 6mil, track to pad 6mil, pad to pad 6mil, via to via 6mil, smd to smd 0mil, copper to edge 10mil, drill to drill 10mil, minimum pad ring 8mil, minimum via ring 6mil, stop-mask expansion 2mil, vias tented up to drill 25mil, thermal gap 10mil

### Footprints (pad centres in the part's own frame; a part is rotated, then mirrored left to right if it is on the bottom)
DISPLAY_UNIT = drill 1 long: !EN! 35.11,3; A 50.35,3; B 52.89,3; GND 45.27,3; PB 47.81,3; SCL 40.19,3; SDA 42.73,3; VCC 37.65,3 | drill 3.3 pad 5: P$1 11.5,3; P$2 88.5,3; P$3 11.5,46; P$4 88.5,46
C0805 = smd 1.1 x 1.3: 1 -0.8,0; 2 0.8,0
10MM = drill 0.9 pad 2.54: + -2.5,0 | drill 0.9 pad 2.54 octagon: - 2.5,0
C1206 = smd 1.6 x 1.8: 1 -1.4,0; 2 1.4,0
200MIL_4X = drill 1.3 long: 1 -7.62,0; 2 -2.54,0; 3 2.54,0; 4 7.62,0
USB_B = drill 1 pad 1.6: +5V 1.25,4.71; DATA+ -1.25,2.71; DATA- -1.25,4.71; GND 1.25,2.71 | drill 2.3 pad 3: S1 -6.02,0; S2 6.02,0
100MIL_3X = drill 1 long: 1 -2.54,0; 2 0,0; 3 2.54,0
200MIL_8X = drill 1.3 long: 1 -17.78,0; 2 -12.7,0; 3 -7.62,0; 4 -2.54,0; 5 2.54,0; 6 7.62,0; 7 12.7,0; 8 17.78,0
100MIL_2X = drill 1 long: 1 -1.27,0; 2 1.27,0
100MIL_4X = drill 1 long: 1 -3.81,0; 2 -1.27,0; 3 1.27,0; 4 3.81,0
100MIL_3X2 = drill 1 octagon: 1 -2.54,1.27; 2 0,1.27; 3 2.54,1.27; 4 -2.54,-1.27; 5 0,-1.27; 6 2.54,-1.27
100MIL_5X = drill 1 long: 1 -5.08,0; 2 -2.54,0; 3 0,0; 4 2.54,0; 5 5.08,0
SOD123 = smd 1.1 x 1.1: A 1.45,0; C -1.45,0
DO214AC = smd 2 x 2: A 2.05,0; C -2.05,0
PCB_115_90 = drill 4.3 pad 5.3: P$1 19,9; P$2 96,9; P$3 19,81; P$4 96,81
SO14 = smd 0.7 x 1.75: 1 -3.81,-2.825; 2 -2.54,-2.825; 3 -1.27,-2.825; 4 0,-2.825; 5 1.27,-2.825; 6 2.54,-2.825; 7 3.81,-2.825; 8 3.81,2.825; 9 2.54,2.825; 10 1.27,2.825; 11 0,2.825; 12 -1.27,2.825; 13 -2.54,2.825; 14 -3.81,2.825
SC70-6 = smd 0.6 x 0.9: 1 -0.7,-1; 3 0.7,-1; 4 0.7,1; 6 -0.7,1 | smd 0.4 x 0.9: 2 0,-1; 5 0,1
SOIC8 = smd 1.75 x 0.7: 1 -2.75,1.905; 2 -2.75,0.635; 3 -2.75,-0.635; 4 -2.75,-1.905; 5 2.75,-1.905; 6 2.75,-0.635; 7 2.75,0.635; 8 2.75,1.905
TQFP44 = smd 1.5 x 0.5: 1 -5.8,4; 2 -5.8,3.2; 3 -5.8,2.4; 4 -5.8,1.6; 5 -5.8,0.8; 6 -5.8,0; 7 -5.8,-0.8; 8 -5.8,-1.6; 9 -5.8,-2.4; 10 -5.8,-3.2; 11 -5.8,-4; 23 5.8,-4; 24 5.8,-3.2; 25 5.8,-2.4; 26 5.8,-1.6; 27 5.8,-0.8; 28 5.8,0; 29 5.8,0.8; 30 5.8,1.6; 31 5.8,2.4; 32 5.8,3.2; 33 5.8,4 | smd 0.5 x 1.5: 12 -4,-5.8; 13 -3.2,-5.8; 14 -2.4,-5.8; 15 -1.6,-5.8; 16 -0.8,-5.8; 17 0,-5.8; 18 0.8,-5.8; 19 1.6,-5.8; 20 2.4,-5.8; 21 3.2,-5.8; 22 4,-5.8; 34 4,5.8; 35 3.2,5.8; 36 2.4,5.8; 37 1.6,5.8; 38 0.8,5.8; 39 0,5.8; 40 -0.8,5.8; 41 -1.6,5.8; 42 -2.4,5.8; 43 -3.2,5.8; 44 -4,5.8
SOT23 = smd 0.8 x 1: 1 -0.95,-1; 2 0.95,-1; 3 0,1
SC70-5 = smd 0.6 x 0.9: 1 -0.7,-1; 3 0.7,-1; 4 0.7,1; 5 -0.7,1 | smd 0.4 x 0.9: 2 0,-1
SOT-23-5 = smd 0.6 x 1.1: 1 -0.95,-1.4; 2 0,-1.4; 3 0.95,-1.4; 4 0.95,1.4; 5 -0.95,1.4
SOT-23-8 = smd 0.45 x 1.1: 1 -0.975,-1.3; 2 -0.325,-1.3; 3 0.325,-1.3; 4 0.975,-1.3; 5 0.975,1.3; 6 0.325,1.3; 7 -0.325,1.3; 8 -0.975,1.3
EIAJ_SOIC8 = smd 2.25 x 0.7: 1 -3,1.905; 2 -3,0.635; 3 -3,-0.635; 4 -3,-1.905; 5 3,-1.905; 6 3,-0.635; 7 3,0.635; 8 3,1.905
SOIC8_PWRPAD = smd 1.75 x 0.7: 1 -2.65,1.905; 2 -2.65,0.635; 3 -2.65,-0.635; 4 -2.65,-1.905; 5 2.65,-1.905; 6 2.65,-0.635; 7 2.65,0.635; 8 2.65,1.905 | smd 2.4 x 3.1: PAD 0,0 | smd 3.5 x 4.5 bottom: PAD_BOTTOM 0,0 | drill 0.6 pad 1 square: VIA1 -0.6,1; VIA2 0.6,1; VIA3 -0.6,0; VIA4 0.6,0; VIA5 -0.6,-1; VIA6 0.6,-1
SSOP8 = smd 1.3 x 0.4: 1 -1.9,0.975; 2 -1.9,0.325; 3 -1.9,-0.325; 4 -1.9,-0.975; 5 1.9,-0.975; 6 1.9,-0.325; 7 1.9,0.325; 8 1.9,0.975
MSS1210 = smd 3 x 5.5: 1 -4.75,0; 2 4.75,0 | smd 3 x 5.5 bottom: 1B -4.75,0; 2B 4.75,0 | drill 0.6 square: 1C -5.5,1.5; 1D -4,1.5; 1E -5.5,0; 1F -4,0; 1G -5.5,-1.5; 1H -4,-1.5; 2C 4,1.5; 2D 5.5,1.5; 2E 4,0; 2F 5.5,0; 2G 4,-1.5; 2H 5.5,-1.5
LPS3015 = smd 0.8 x 2.4: 1 -1.25,0; 2 1.25,0.05 | smd 1.2 x 3 bottom: 1B -1.1,0; 2B 1.1,0 | drill 0.6 pad 1: 1C -1.1,1; 1E -1.1,-1; 2C 1.1,1; 2E 1.1,-1 | drill 0.4 pad 0.8: 1D -1.25,0; 2D 1.25,0
MSS1038 = smd 2 x 3.8: 1 -4.7,0; 2 4.7,0 | smd 1.8 x 3.6 bottom: 1B -4.7,0; 2B 4.7,0 | drill 0.6 square: 1C -4.8,1.2; 1D -4.8,0; 1E -4.8,-1.2; 2C 4.8,1.2; 2D 4.8,0; 2E 4.8,-1.2
LFPAK = smd 0.7 x 1.15: 1 -1.905,-2.725; 2 -0.635,-2.725; 3 0.635,-2.725; 4 1.905,-2.725 | smd 4.2 x 3.1: MB1 0,0.45 | smd 4.7 x 1.5: MB2 0,2.75 | smd 4.7 x 4.6 bottom: MB3 0,1.2 | drill 0.6 square: VIA1 -1.4,2.4; VIA2 0,2.4; VIA3 1.4,2.4; VIA4 -1.4,1; VIA5 0,1; VIA6 1.4,1; VIA7 -1.4,-0.4; VIA8 0,-0.4; VIA9 1.4,-0.4
R0805 = smd 1.1 x 1.3: 1 -0.8,0; 2 0.8,0
R1206 = smd 1.6 x 1.803: 1 -1.422,0; 2 1.422,0
3.2X1.5MM = smd 1.2 x 1.8: 1 -1.25,0; 2 1.25,0
5X3.2MM = smd 1.9 x 2.4: 1 -2.05,0; 2 2.05,0
USB_A = drill 0.8 pad 1.3 long: 1 -3.5,2.71; 2 -1,2.71; 3 1,2.71; 4 3.5,2.71 | drill 2 pad 2.9: S1 -6.57,0; S2 6.57,0

### Placement (x,y rotation side)
BRD1  -7.5,14.5 0 top
C1  43.94,48.9 90 top
C2  53.14,53.66 90 top
C3  9.01,63.18 90 top
C4  17.58,54.29 0 top
C5  17.58,43.81 0 top
C6  12.18,37.78 180 top
C7  17.9,37.47 0 top
C8  12.5,22.23 270 top
C9  21.39,22.86 270 top
C10  28.06,54.29 180 top
C11  36,62.87 270 top
C12  43.62,53.34 270 top
C13  77.59,41.59 270 top
C14  67.11,32.7 270 top
C15  61.72,47.47 180 top
C16  60.44,41.27 270 top
C17  59.17,51.44 90 top
C18  64.57,31.11 90 top
C19  62.67,31.11 90 top
C20  55.05,37.47 270 top
C21  55.05,40.64 90 top
C22  1.8n  [C0805]  64.25,51.44 90 top
C23  38.22,46.67 180 top
C24  41.08,32.23 180 top
C25  40.44,30 180 top
C26  68.06,56.2 0 top
C27  45.84,36.83 180 top
C28  37.9,34.92 270 top
C29  40.12,35.88 270 top
C30  82.99,22.86 90 top
C31  60.13,14.29 0 top
C32  60.13,16.51 0 top
C33  60.13,18.41 180 top
C34  13.77,10.79 90 top
C35  55.05,26.04 270 top
C36  52.51,22.86 90 top
C37  56,16.51 0 top
C38  31.55,10.79 90 top
C39  46.16,4.76 90 top
C40  48.38,4.76 90 top
C41  57.59,1.27 0 top
C42  58.86,26.04 90 top
C43  44.89,65.72 0 top
C44  65.21,65.72 0 top
C45  75.37,46.67 0 top
C46  68.06,49.85 270 top
C47  66.16,51.44 270 top
CON1  22.66,71.12 0 top
CON2  69.02,4.13 0 top
CON4  2.66,46.35 90 top
CON5  2.66,38.73 90 top
CON6  53.14,71.12 0 top
CON7  2.66,27.94 90 top
CON8  82.35,51.75 90 top
CON9  80.45,30.16 0 top
CON11  82.35,40.32 90 top
D1  12.5,19.68 0 top
D2  25.36,32.7 90 top
D3  7.42,25.4 90 top
D4  68.7,15.24 0 top
D5  9.01,67.63 180 top
D6  79.5,67.47 0 top
DRL1  -15,-6 0 top
IC1  48.38,50.48 270 top
IC2  11.55,63.18 270 top
IC3  17.9,21.27 270 top
IC4  33.46,62.87 90 top
IC5  PIC18F46J50  [TQFP44]  68.7,41.59 180 top
IC6  TS6001  [SOT23]  61.72,51.44 0 top
IC7  38.22,44.13 0 top
IC8  68.7,53.66 90 top
IC9  42.66,35.24 0 top
IC10  77.59,24.13 0 top
IC11  56,20.95 270 top
IC12  44.89,61.91 90 top
IC13  65.21,61.91 90 top
L1  29.65,42.23 270 top
L2  41.08,39.37 180 top
L3  55.05,7.94 270 top
Q1  9.64,57.78 270 top
Q2  20.44,62.87 0 top
Q3  32.19,23.5 90 top
Q4  29.01,26.04 90 top
Q5  15.36,32.7 0 top
Q6  21.71,32.07 180 top
Q7  37.9,53.34 90 top
Q8  48.7,39.05 90 top
Q9  72.83,51.44 0 top
Q10  75.69,54.29 0 top
Q11  40.44,62.87 0 top
Q12  60.76,62.87 0 top
Q13  50.6,62.87 0 top
Q14  70.92,62.87 0 top
Q15  8.69,29.53 90 top
R1  11.55,60.33 90 top
R2  9.64,54.93 180 top
R3  15.04,63.82 270 top
R4  28.7,23.18 180 top
R5  33.46,26.99 270 top
R6  14.41,22.23 270 top
R7  30.28,63.82 90 top
R8  36.95,56.67 90 top
R9  40.76,53.34 90 top
R10  35.05,56.67 90 top
R11  50.28,45.09 180 top
R12  46.48,45.09 0 top
R13  79.5,37.62 270 top
R14  45.84,33.02 0 top
R16  45.84,34.92 0 top
R17  45.84,31.11 180 top
R18  18.54,9.53 180 top
R19  15.68,10.79 270 top
R20  17.58,12.38 270 top
R21  21.39,10.79 270 top
R22  19.49,12.38 270 top
R23  36.31,9.53 180 top
R24  33.46,10.79 270 top
R25  35.36,12.38 270 top
R26  39.17,10.79 270 top
R27  37.27,12.38 270 top
R28  60.76,26.04 90 top
R29  62.67,26.04 90 top
R30  56.95,26.04 270 top
R31  72.83,55.24 90 top
R32  75.37,50.8 90 top
R33  42.35,43.18 0 top
R34  8.06,46.35 0 top
R35  7.42,35.56 270 top
X1  63.62,33.81 0 top
X2  57.91,39.05 270 top
X3  18.54,4.13 0 top
X4  36.31,4.13 0 top

### Tracks (layer width: path | path; a pad name or v marks a point on that pad's centre or on a via)
5V_ON  (via drill 0.4)
  Top 0.305: IC11.1 57.91,23.81 62.67,23.81 v62.98,24.13 | IC5.41 70.29,35.78 70.29,34.61 69.97,34.29 69.97,30.48 66.8,27.3 66.16,27.3 v64.73,25.88
  Bottom 0.305: v62.98,24.13 v64.73,25.88
!DISP_EN!
  Top 0.305: BRD1.!EN! 27.61,15.05 28.38,14.29 47.11,14.29 49.33,16.51 49.33,23.81 55.52,30 59.33,30 60.76,28.57 66.16,28.57 68.38,30.8 68.38,34.29 67.9,34.77 IC5.38
!MCLR!  (via drill 0.4)
  Top 0.305: IC5.18 67.9,44.46 v68.54,43.81 | v76.64,43.5 78.54,43.5 80.13,41.91 80.13,39.69 80.77,39.05 83.62,39.05 84.26,38.42 84.26,35.56 83.94,35.24 CON11.1 80.29,35.24 79.5,36.04 R13.2
  Bottom 0.305: v68.54,43.81 76.32,43.81 v76.64,43.5
!SS1!
  Top 0.305: IC10.4 76,22.23 76.32,22.54 76.32,23.81 79.5,26.99 80.45,26.99 81.72,28.26 81.72,31.75 77.59,35.88 77.59,39.05 75.85,40.79 IC5.5
!SS2!
  Top 0.305: IC5.39 68.7,36.67 69.02,36.99 73.14,36.99 73.46,36.67 73.46,30.8 75.37,28.89 CON9.4
+5V  (via drill 0.6, 1 pad 1.52)
  Top 0.305: 20.76,3.81 20.76,7.94 21.39,8.57 R21.2 | 38.54,4.13 38.54,7.94 39.17,8.57 R26.2 | C42.2 R28.2 R29.2 63.77,26.84 63.94,26.67 63.94,11.11 56.32,3.49
  Top 1.778: 54.73,2.54 54.41,2.22
  other vias: 19.17,2.22 16,2.22 17.58,2.22 20.76,2.22 22.34,2.22 32.82,2.22 34.41,2.22 36,2.22 37.59,2.22 39.17,2.22 45.05,1.27 46.63,1.27 48.22,1.27 49.81,1.27 51.55,1.27 53.46,1.27 55.05,1.27 49.97,3.49 51.55,3.49
  pour Top (isolate 0.254, no thermals): 57.27,4.76 57.27,0.32 16.63,0 13.77,2.86 13.77,5.08 12.82,6.03 12.82,10.48 16.63,10.48 16.63,5.71 17.27,5.08 21.07,5.08 23.61,2.22 25.84,2.22 26.79,3.17 28.06,3.17 29.01,2.22 30.6,2.22 31.55,3.17 31.55,5.08 30.6,6.03 30.6,10.48 34.41,10.48 34.41,5.71 35.05,5.08 38.85,5.08 41.71,2.22 43.94,2.22 44.89,2.86 44.89,4.76
  pour Bottom (isolate 0.254, no thermals): 57.27,0.32 57.27,4.76 44.89,4.76 44.89,2.86 43.94,2.22 41.71,2.22 38.85,5.08 35.05,5.08 34.41,5.71 34.41,7.94 34.09,8.26 31.87,8.26 31.55,7.94 31.55,3.17 30.6,2.22 29.01,2.22 28.06,3.17 26.79,3.17 25.84,2.22 23.61,2.22 21.07,5.08 17.27,5.08 16.63,5.71 16.63,7.94 16.31,8.26 14.09,8.26 13.77,7.94 13.77,2.86 16.63,0
BATTERY  (via drill 0.6)
  Top 0.305: R8.2 R10.2 35.05,58.42 34.73,58.74 33.14,58.74 32.82,59.05 32.82,60.96 33.46,61.59 33.46,62.87 | Q10.2 76.64,54.29 75.05,54.29 74.73,54.61 74.73,55.56 74.25,56.05 R31.2 | R7.2 30.28,64.29 30.44,64.14 31.55,64.14 31.71,64.29 33.14,64.29 33.46,63.98 33.46,62.87 | IC4.5 33.46,62.87
  other vias: 58.06,11.27 65.05,11.43 69.65,28.26 78.54,47.94 58.06,12.86 59.33,12.86 58.7,12.06 59.33,11.27 65.05,13.34 66.16,13.34 69.65,26.99 66.16,11.43 67.27,11.43 67.27,13.34 68.7,27.62 68.7,26.35 68.7,25.08 69.65,25.72 77.27,49.21 77.27,47.94 78.54,49.21 79.81,49.21 79.81,47.94 65.68,12.38 66.8,12.38
  pour Top (isolate 0.254, rank 2, no thermals): 28.06,64.77 28.06,77.79 66.48,77.79 68.38,75.88 68.38,69.85 67.75,69.22 63.62,69.22 62.98,69.85 62.98,72.71 62.35,73.34 59.17,73.34 58.54,72.71 58.54,69.85 57.91,69.22 53.46,69.22 52.83,69.85 52.83,72.71 52.19,73.34 49.02,73.34 48.38,72.71 48.38,69.85 47.74,69.22 43.3,69.22 42.66,69.85 42.66,72.71 42.03,73.34 38.85,73.34 38.22,72.71 38.22,69.85 37.27,68.9 37.27,67.94 34.41,64.77
  pour Top (isolate 0.254, no thermals): 57.59,19.37 59.81,19.37 59.81,10.79 57.59,10.79
  pour Bottom (isolate 0.254, rank 2, no thermals): 68.38,69.85 68.38,75.56 66.48,77.47 28.85,77.63 28.85,67.15 37.43,67.15 37.43,69.06 38.22,69.85 38.22,72.71 38.85,73.34 42.03,73.34 42.66,72.71 42.66,69.85 43.3,69.22 47.74,69.22 48.38,69.85 48.38,72.71 49.02,73.34 52.19,73.34 52.83,72.71 52.83,69.85 53.46,69.22 57.91,69.22 58.54,69.85 58.54,72.71 59.17,73.34 62.35,73.34 62.98,72.71 62.98,69.85 63.62,69.22 67.75,69.22
  pour Bottom (isolate 0.254, no thermals): 57.91,10.79 67.43,10.79 67.75,11.11 67.75,13.65 67.43,13.97 57.91,13.97 57.59,13.65 57.59,11.11
  pour Top (isolate 0.254, no thermals): 70.29,28.89 70.29,25.08 67.75,22.54 67.75,11.11 67.43,10.79 64.89,10.79 64.25,11.43 64.25,24.45 69.02,28.89
  pour Bottom (isolate 0.254, no thermals): 68.06,27.94 76.64,36.2 76.64,49.53 76.95,49.85 80.13,49.85 80.45,49.53 80.45,35.56 69.33,24.45 68.06,24.45
  pour Top (isolate 0.254, rank 2, no thermals): 80.45,47.62 80.13,47.31 77.27,47.31 76.64,47.94 76.64,56.2 74.42,58.42 74.42,69.22 73.46,70.17 73.46,73.03 72.83,73.66 69.33,73.66 68.38,72.71 66.48,72.71 66.48,77.79 75.37,77.79 77.59,75.56 77.59,73.34 79.18,71.75 79.18,62.87 78.07,61.75 78.07,59.21 80.45,56.83
BUCK_ON  (via drill 0.4)
  Top 0.305: IC5.9 72.69,43.99 70.45,41.75 v70.45,41.43 | 9.48,62.53 arc90 C3.1 9.16,62.53 8.07,62.53 7.74,62.87 7.74,64.77 9.33,66.36 9.33,68.9 9.64,69.22 11.23,69.22 11.87,69.85 11.87,72.39 13.77,74.3 v21.71,74.3 | v34.09,46.35 33.77,46.67 v33.77,57.78 | Q3.1 32.51,22.54 32.19,22.86 32.19,30.48 34.09,32.38 v34.09,39.85 34.89,40.64 38.38,40.64 39.81,42.07 48.7,42.07 49.02,41.75 50.28,41.75 50.44,41.91 v53.78,41.91 | 35.85,63.52 C11.1 | v36.47,65.72 37.27,64.93 37.27,63.5 | 37.27,63.5 37.27,59.37 36.95,59.05 v35.68,59.05 | C11.1 37.1,63.66 37.27,63.5 | IC4.3 35.9,63.56 C11.1
  Top 0.406: IC2.3 9.11,62.48 C3.1
  Bottom 0.305: v21.71,74.3 27.27,74.3 27.74,73.82 27.74,66.83 28.54,66.04 36.16,66.04 v36.47,65.72 | v34.09,46.35 33.46,45.72 33.46,44.45 33.77,44.13 33.77,40.16 v34.09,39.85 | v70.45,41.43 69.02,41.43 68.06,42.39 66.95,42.39 65.84,43.5 58.22,43.5 56.64,41.91 v53.78,41.91 | v35.68,59.05 34.41,57.78 v33.77,57.78
BUCK_SUPPLY  (via drill 0.6)
  Top 0.406: C9.1 19.8,23.66 | 19.8,23.66 IC3.1 19.8,25.4 20.44,26.04 Q4.3 | v25.84,39.69 33.14,39.69 33.46,39.37 33.46,32.7 28.01,27.26 Q4.3 | v18.22,55.88 v18.22,39.69 | 28.06,26.08 Q4.3 | Q2.4 v22.34,58.74 | 19.8,23.66 19.8,23.18 18.54,21.91 16.63,21.91 16,21.27 16,20.32 15.36,19.68 D1.A
  Bottom 0.406: v25.84,39.69 v18.22,39.69 | v22.34,58.74 21.07,58.74 v18.22,55.88
D1+
  Top 0.305: X3.3 19.34,7.04 R18.1 19.34,11.58 R22.2 19.5,11.6 R21.1
D1-
  Top 0.305: X3.2 17.73,7.04 R18.2 17.73,11.58 R20.2 15.69,11.58 R19.1
D2+
  Top 0.305: X4.3 37.12,7.04 R23.1 37.12,11.58 R27.2 37.27,11.6 R26.1
D2-
  Top 0.305: X4.2 35.52,7.04 R23.2 35.52,11.58 R25.2 35.36,11.6 R24.1
ENC_PB  (via drill 0.4)
  Top 0.305: IC5.19 67.1,46.02 65.84,44.77 65.84,40.96 v65.21,40.32 | v58.54,34.29 55.05,34.29 48.38,27.62 45.84,27.62 44.89,26.67 44.89,20.32 44.57,20 41.08,20 40.31,19.23 BRD1.PB
  Bottom 0.305: v58.54,34.29 58.54,36.2 60.76,38.42 63.3,38.42 v65.21,40.32
FAN_ON  (via drill 0.4)
  Top 0.305: IC5.40 69.5,34.77 69.18,34.45 69.18,30.64 66.48,27.94 60.44,27.94 59.02,29.37 55.84,29.37 49.97,23.5 49.97,16.19 47.43,13.65 39.81,13.65 v39.49,13.34 | v9.64,27.62 9.64,28.53 Q15.1
  Bottom 0.305: v39.49,13.34 38.54,14.29 17.27,14.29 9.96,21.59 9.96,27.3 v9.64,27.62
GND  (via drill 0.4, 0.6)
  Top 0.305: IC2.2 IC2.1
  Top 0.406: C9.2 20.59,22.06 | 42.35,33.34 42.35,35.24
  other vias: 62.98,16.51 62.98,15.24 62.98,17.78 56.64,28.42 58.22,28.42 52.83,20.64 52.83,19.37 51.55,20.64 51.55,19.37 60.44,22.86 60.44,21.59 60.44,20.32 61.72,20.32 61.72,21.59 61.72,22.86 62.98,22.86 62.98,21.59 62.98,20.32 62.98,19.05 48.38,9.53 48.38,7.78 46.79,7.78 46.79,9.53 45.2,9.53 29.97,12.06 29.97,11.11 12.18,12.06 12.18,11.11 44.25,67.94 45.52,67.94 46.79,67.94 64.57,67.94 65.84,67.94 67.11,67.94 44.73,61.28 65.05,61.28 48.7,58.74 49.97,58.74 51.24,58.74 58.86,58.74 60.13,58.74 61.4,58.74 69.02,58.58 70.29,58.58 71.56,58.58 38.54,58.74 39.81,58.74 41.08,58.74 72.83,40.8 61.4,40.96 56.64,39.05 53.46,39.05 63.62,48.9 62.35,48.9 11.55,65.41 20.12,22.23 18.54,20 17.27,20.32 9.01,38.42 9.01,37.15 22.34,35.88 23.61,35.88 21.07,35.88 75.69,41.59 65.21,58.42 45.52,58.42 33.46,29.21 33.46,30.48 38.54,34.77 36.95,30 36.95,30.96 36.95,31.91 37.9,31.91 38.85,31.91 41.71,35.24 42.66,35.24 43.62,35.24 40.76,33.66 37.59,34.77 36.63,34.77 47.74,32.07 47.74,31.11 23.93,16.51 24.88,16.51 25.84,16.51 22.98,13.34 23.93,13.34 24.88,13.34 25.84,13.34 26.79,13.34 50.92,39.69 50.92,38.42 67.27,31.27 66.8,30.48 47.43,50.48 47.43,49.21 49.65,49.21 49.65,47.62 12.82,26.04 12.82,25.08 9.01,26.67 9.01,25.56 49.97,9.53 51.55,9.53 53.14,9.53 54.73,9.53 56.32,9.53 57.91,9.53 59.49,9.53 57.91,7.78 56.32,7.78 56.32,6.03 54.73,6.03 54.73,7.78 53.14,7.78 53.14,6.03 51.55,6.03 51.55,7.78 49.97,7.78 49.97,6.03 45.2,7.78 59.81,2.22 59.81,0.95 53.46,25.4 72.83,39.85 61.08,31.75 61.08,30.48 77.59,22.54 83.31,24.77 82.03,24.77 78.54,24.77 78.54,23.5 74.42,48.58 75.69,48.58 59.81,53.66 62.03,53.66 64.25,53.66 66.16,53.66 68.06,53.34 68.06,51.75 70.29,55.88 70.29,56.83 39.49,33.66 11.55,54.93 11.55,56.52 52.83,18.1 52.83,16.83 51.55,16.83 51.55,18.1 59.17,22.86 59.17,21.59 59.17,20.32 41.08,25.08 41.08,23.5 9.96,65.41 34.41,61.28 34.41,60.01 35.68,60.64 40.12,51.12 41.4,51.12 42.66,51.12 43.94,51.12 40.76,48.9 40.76,47.31 49.33,51.75 50.28,56.04 51.55,56.04 52.83,56.04 19.17,40.96 21.07,40.96 22.98,40.96 24.88,40.96 24.57,38.42 22.98,38.42 21.39,38.42 19.8,38.42 26.79,44.13 28.7,44.13 30.6,44.13 32.51,44.13 32.51,42.55 32.51,40.96 30.6,40.96 30.6,42.55 28.7,40.96 28.7,42.55 26.79,42.55 26.79,40.96 35.68,47.62 35.68,46.04 35.68,44.45 35.68,42.86 24.88,42.55 24.88,44.13 24.88,45.72 24.88,47.31 25.2,35.88 18.54,35.88 9.01,39.69 7.74,39.69 7.74,38.42 20.12,56.2 20.12,52.39 25.52,52.39 25.52,56.2 20.12,45.72 20.44,20.95 19.17,20.95 9.01,24.45 8.38,32.07 9.64,32.07 9.01,35.88 53.46,37.31 37.59,41.59 40.76,45.72 74.73,36.51 70.92,53.66 74.42,35.24 76.95,30.16 74.73,27.62 69.33,48.9 74.1,52.07 72.83,49.53
  pour Bottom (isolate 0.254, rank 5, no thermals): 0,50.5 0,75 arc-90 3,78 12.5,78 82,78 arc-90 85,75 85,46.5 85,3 arc-90 82,0 60.5,0 3,0 arc-90 0,3
  pour Top (isolate 0.254, rank 5, no thermals): 0,50.5 0,75 arc-90 3,78 16.5,78 82,78 arc-90 85,75 85,58 85,3 arc-90 82,0 61,0 3,0 arc-90 0,3
HI  (via drill 0.4)
  Top 0.305: IC3.5 16,17.14 16.47,16.67 20.6,16.67 23.61,19.68 39.17,19.68 40.12,20.64 43.94,20.64 44.25,20.95 44.25,26.99 45.52,28.26 48.06,28.26 54.73,34.92 58.06,34.92 58.22,35.08 59.02,35.08 59.17,34.92 61.24,34.92 v62.67,36.35 | v65.05,37.31 67.75,40.01 69.02,40.01 69.02,42.23 72.38,45.59 IC5.11
  Bottom 0.305: v62.67,36.35 64.1,36.35 v65.05,37.31
HIGH_GATE  (via drill 0.4, 0.9)
  Top 0.406: v17.27,29.84 Q5.4
  Top 0.61: IC3.3 v17.27,24.92
  Top 0.813: v17.27,30.8 v17.27,29.84 | v17.27,24.92 v17.27,25.88 v18.54,25.88
  Bottom 0.813: v17.27,25.88 v17.27,29.84 v17.27,30.8 | v17.27,25.88 v17.27,24.92 | v17.27,25.88 v18.54,25.88
IIN_SENSE  (via drill 0.4)
  Top 0.305: v22.34,73.5 21.39,73.5 21.23,73.66 18.54,73.66 17.58,72.71 17.58,64.14 17.27,63.82 12.61,63.82 IC2.6 | IC1.11 48.38,50.48 48.38,55.56 48.06,55.88 44.57,55.88 43.62,56.83 v38.22,56.83
  Bottom 0.305: v22.34,73.5 22.5,73.66 26.63,73.66 27.11,73.18 27.11,66.67 28.38,65.41 35.68,65.41 36.63,64.45 36.63,58.1 37.9,56.83 v38.22,56.83
IOUT_SENSE  (via drill 0.4)
  Top 0.305: IC1.3 47.74,51.75 47.74,54.93 47.43,55.24 44.25,55.24 43.46,56.04 v39.01,56.04 | v32.51,58.1 32.19,58.42 32.19,61.28 32.46,61.55 IC4.6
  Bottom 0.305: v39.01,56.04 37.74,56.04 36.79,56.99 33.46,56.99 32.51,57.94 v32.51,58.1
LI  (via drill 0.4)
  Top 0.305: IC3.6 17.27,17.46 17.58,17.14 20.28,17.14 23.46,20.32 38.85,20.32 39.81,21.27 43.3,21.27 43.62,21.59 43.62,27.3 45.2,28.89 47.74,28.89 54.41,35.56 60.92,35.56 v61.08,35.72 | IC5.10 72.53,44.79 69.65,41.91 69.65,39.37 68.38,39.37 v66.32,37.31
  Bottom 0.305: v61.08,35.72 62.03,35.72 62.19,35.56 64.57,35.56 v66.32,37.31
LOW_GATE  (via drill 0.4, 0.9 pad 1.52)
  Top 0.61: v18.54,30.8 18.54,33.18 19.8,34.45 Q6.4 | 22.66,21.43 22.66,21.27 21.07,19.68 20.12,19.68 19.8,19.37 IC3.8 | 22.66,21.43 22.66,24.45 22.03,25.08 v21.71,25.08 | v23.93,21.43 22.66,21.43
  Top 0.813: v21.71,25.08 v20.76,25.08 | v18.54,30.8 v18.54,29.84
  Bottom 0.813: v18.54,30.8 v18.54,29.84 18.54,28.1 20.76,25.88 v20.76,25.08 v21.71,25.08
MISO  (via drill 0.4)
  Top 0.305: IC5.4 75.7,39.99 76.95,38.73 76.95,35.56 80.45,32.07 CON9.2 | v81.4,26.99 81.4,26.04 IC10.8
  Bottom 0.305: CON9.2 80.45,31.11 81.72,29.84 81.72,27.3 v81.4,26.99
MOSI
  Top 0.305: IC5.2 75.39,38.39 75.69,38.1 75.69,34.92 77.91,32.7 CON9.1 77.91,30.8 79.18,29.53 79.18,28.57 76.64,26.04 IC10.1
N$1
  Top 0.406: R6.2 C8.2 | 12.35,21.27 C8.2 | D1.C 11.07,19.71 11.07,20.8 11.7,21.43 C8.2
N$2
  Top 0.406: IC5.23 62,45.59 60.31,47.28 C15.2
N$3
  Top 0.305: Q9.3 72.83,53.34 | 72.83,53.34 R31.1 | Q10.1 72.88,53.29 72.83,53.34
N$4
  Top 0.305: R33.1 38.97,43.18 IC7.3
N$5
  Top 0.305: Q8.3 47.7,33.29 47.43,33.02 R14.2
N$6
  Top 0.305: Q1.3 11.23,57.78 11.55,58.1 R1.1
N$7
  Top 0.305: R34.1 CON4.2
N$8
  Top 0.406: R6.1 14.88,23.02 15.36,22.54 18.22,22.54 18.54,22.86 IC3.2
N$9  (3 unrouted)
  Top 0.406: IC9.7 42.34,39.33
N$10
  Top 0.406: D3.A 7.42,29.26 Q15.3 4.88,29.53 4.56,29.21 CON7.2
N$11
  Top 0.305: R14.1 R17.2 R16.1 C27.2 44.75,36.54 IC9.5
N$12
  Top 0.406: IC11.7 56.64,16.68 C37.2
N$13  (1 unrouted)
  Top 0.406: IC11.6 55.37,17.46 55.05,17.14 55.05,16.68
  pour Top (isolate 0.254, rank 2, no thermals): 54.73,19.05 56,19.05 56,15.56 57.27,15.56 57.27,11.75 56.95,11.43 53.14,11.43 52.83,11.75 52.83,15.56 54.73,17.46
N$14
  Top 0.305: CON5.2 6.15,38.73 7.42,37.47 R35.1
N$15
  Top 0.406: IC11.3 55.37,24.92 C35.2
N$16
  Top 0.406: Q3.3 29.97,23.5 | 29.97,23.5 29.81,23.5 R4.1 | Q4.1 30.01,23.54 29.97,23.5
N$17
  Top 0.305: R10.1 R8.1 36.95,53.39 Q7.3
N$19
  Top 0.406: Q3.2 33.19,25.92 R5.2
N$20
  Top 0.305: IC11.4 52.56,23.61 C36.2
N$22
  Top 0.305: IC11.2 56.64,24.92 R30.2 C42.1 R28.1 R29.1
N$24
  Top 0.305: IC12.7 44.56,63.17 43.78,62.39 43.78,62.07 42.35,60.64 Q11.4
N$28  (via drill 0.4)
  Top 0.305: 72.85,60.17 Q14.4 73.12,59.85 v73.62,59.85 | IC13.5 66.18,62.41 v66.16,62.39
  Bottom 0.305: v66.16,62.39 66.16,61.75 67.91,60.01 73.46,60.01 v73.62,59.85
N$31
  Top 0.305: IC13.7 64.88,63.17 64.25,62.55 64.25,62.07 62.67,60.48 Q12.4
N$33  (via drill 0.4)
  Top 0.305: Q13.4 52.96,60.14 v53.46,60.64 | IC12.5 45.86,62.41 v45.84,62.39
  Bottom 0.305: v45.84,62.39 45.84,62.23 47.59,60.48 53.3,60.48 v53.46,60.64
N$34
  Top 0.305: 75.2,51.44 R32.2 74.94,51.6 Q9.2
OSC1
  Top 0.305: C21.2 55.05,41.1 X2.1 57.91,40.01 58.54,39.37 61.08,39.37 61.7,39.99 IC5.30
OSC2
  Top 0.305: C20.2 55.05,37 X2.2 57.91,38.42 58.22,38.73 61.4,38.73 61.86,39.19 IC5.31
OUT1_GND
  pour Top (isolate 0.254, no thermals): 38.85,73.03 42.03,73.03 42.35,72.71 42.35,69.85 43.3,68.9 43.3,62.23 42.66,61.59 38.22,61.59 37.59,62.23 37.59,68.9 38.54,69.85 38.54,72.71
  pour Bottom (isolate 0.254, no thermals): 37.59,68.9 38.54,69.85 38.54,72.71 38.85,73.03 42.03,73.03 42.35,72.71 42.35,69.85 43.3,68.9 43.3,62.23 42.66,61.59 38.22,61.59 37.59,62.23
OUT1_ON
  Top 0.305: IC12.2 44.57,57.78 45.2,57.15 54.09,57.15 56,55.24 56,45.4 56.95,44.45 59.97,44.45 62.03,42.39 IC5.27
OUT2_GND
  pour Top (isolate 0.254, no thermals): 48.7,69.85 48.7,72.71 49.02,73.03 52.19,73.03 52.51,72.71 52.51,69.85 53.46,68.9 53.46,62.23 52.83,61.59 48.38,61.59 47.74,62.23 47.74,68.9
  pour Bottom (isolate 0.254, no thermals): 48.38,61.59 47.74,62.23 47.74,68.9 48.7,69.85 48.7,72.71 49.02,73.03 52.19,73.03 52.51,72.71 52.51,69.85 53.46,68.9 53.46,62.23 52.83,61.59
OUT2_ON
  Top 0.305: IC12.4 45.86,59.35 47.43,57.78 54.41,57.78 56.64,55.56 56.64,45.72 57.43,44.93 60.29,44.93 62.02,43.19 IC5.26
OUT3_GND
  pour Top (isolate 0.254, no thermals): 58.86,69.85 58.86,72.71 59.17,73.03 62.35,73.03 62.67,72.71 62.67,69.85 63.62,68.9 63.62,62.23 62.98,61.59 58.54,61.59 57.91,62.23 57.91,68.9
  pour Bottom (isolate 0.254, no thermals): 63.62,62.23 62.98,61.59 58.54,61.59 57.91,62.23 57.91,68.9 58.86,69.85 58.86,72.71 59.17,73.03 62.35,73.03 62.67,72.71 62.67,69.85 63.62,68.9
OUT3_ON
  Top 0.305: IC13.2 64.89,59.37 63.3,57.78 59.49,57.78 57.27,55.56 57.27,46.04 57.91,45.4 60.6,45.4 62.01,43.99 IC5.25
OUT4_GND
  pour Top (isolate 0.254, no thermals): 68.7,69.53 68.7,72.71 69.33,73.34 72.51,73.34 73.14,72.71 73.14,69.85 74.1,68.9 74.1,62.55 73.14,61.59 68.7,61.59 68.06,62.23 68.06,68.9
  pour Bottom (isolate 0.254, no thermals): 68.7,61.59 68.06,62.23 68.06,68.9 68.7,69.53 68.7,72.71 69.33,73.34 72.51,73.34 73.14,72.71 73.14,69.85 74.1,68.9 74.1,62.55 73.14,61.59
OUT4_ON
  Top 0.305: IC13.4 66.16,59.99 66.16,57.78 65.53,57.15 59.81,57.15 57.91,55.24 57.91,46.35 58.38,45.88 60.92,45.88 62.01,44.79 IC5.24
OUT_ON  (via drill 0.4)
  Top 0.305: v68.22,41.12 68.22,42.39 72.03,46.2 72.99,46.2 73.46,46.67 73.46,48.26 73.14,48.58 72.19,48.58 71.88,48.89 Q9.1 | IC5.1 69.84,37.59 v69.65,37.78
  Bottom 0.305: v69.65,37.78 69.65,39.69 v68.22,41.12
OUT_PWR  (via drill 0.4)
  Top 0.305: C43.2 45.52,65.56 45.52,64.77 45.21,64.46 IC12.6 45.21,63.03 45.05,62.87 45.05,62.23 46.63,60.64 v46.63,59.85 | C44.2 65.84,65.56 65.84,64.77 65.53,64.46 IC13.6 65.53,63.03 65.37,62.87 65.37,62.23 66.95,60.64 v66.95,59.85 | v73.46,58.9 73.46,58.74 75.69,56.52 Q10.3
  Bottom 0.305: v46.63,59.85 v66.95,59.85 67.27,59.53 72.83,59.53 v73.46,58.9
PANEL+
  Top 0.305: 11.55,62.55 11.55,64.29 11.87,64.61 13.45,64.61 13.61,64.45 15.04,64.45 R3.1 | 11.55,62.55 R1.2 | IC2.4 11.61,62.48 11.55,62.55
  pour Top (isolate 0.254, no thermals): 17.58,72.39 17.58,65.09 12.82,65.09 12.5,65.41 12.5,66.04 11.87,66.67 10.6,66.67 10.6,68.58 11.87,68.58 12.5,69.22 12.5,72.39 13.45,73.34 16.63,73.34
PANEL-
  pour Top (isolate 0.254, rank 2, no thermals): 17.9,72.39 18.85,73.34 21.71,73.34 22.66,72.39 22.66,66.04 22.98,65.72 22.98,62.87 22.66,62.55 18.22,62.55 17.9,62.87
  pour Bottom (isolate 0.254, rank 2, no thermals): 18.06,61.75 22.82,61.75 22.82,68.26 21.55,69.53 21.55,71.91 20.6,73.18 19.65,73.18 18.06,71.75
PGC/ENC_A  (via drill 0.4)
  Top 0.305: IC5.16 69.5,45.55 v69.65,45.4 | v76.64,45.4 CON11.5 | v59.49,33.81 59.17,33.5 58.06,33.5 57.91,33.66 55.37,33.66 48.7,26.99 46.16,26.99 45.52,26.35 45.52,20 44.89,19.37 43.3,19.37 42.85,18.92 BRD1.A | v67.11,44.77 66.48,44.13 66.48,40.64 v65.05,39.21
  Bottom 0.305: v76.64,45.4 v69.65,45.4 67.75,45.4 v67.11,44.77 | v65.05,39.21 63.62,37.78 61.08,37.78 59.49,36.2 v59.49,33.81
PGD/ENC_B  (via drill 0.4)
  Top 0.305: IC5.17 68.7,45.09 v69.18,44.61 | v76.64,44.45 78.54,44.45 80.13,42.86 CON11.4 | v67.43,43.81 67.43,40.64 v66.16,39.37 | v60.76,33.97 59.81,33.02 57.75,33.02 57.59,33.18 55.84,33.18 49.02,26.35 46.48,26.35 46.16,26.04 46.16,19.68 45.39,18.92 BRD1.B
  Bottom 0.305: v76.64,44.45 76.48,44.61 v69.18,44.61 68.22,44.61 v67.43,43.81 | v66.16,39.37 63.94,37.15 61.4,37.15 60.13,35.88 60.13,34.61 v60.76,33.97
SCL  (via drill 0.4)
  Top 0.305: v47.9,25.56 47.43,25.08 47.43,18.89 47.11,18.57 47.11,15.56 46.48,14.92 33.46,14.92 32.69,15.69 BRD1.SCL | v50.28,33.34 50.28,35.56 52.51,37.78 52.51,39.69 v52.83,40.01 | IC5.14 71.1,50.62 v70.92,50.8 70.92,51.12 70.1,51.94 IC8.1 | v54.41,46.67 53.46,45.72 53.46,45.24 v52.83,44.61 52.03,44.61 51.55,45.09 R11.1 51.2,45.2 IC1.8
  Bottom 0.305: v54.41,46.67 58.54,50.8 v70.92,50.8 71.24,50.48 CON8.2 | v47.9,25.56 50.28,27.94 v50.28,33.34 | v52.83,40.01 52.83,40.48 52.51,40.8 52.51,43.18 52.83,43.5 v52.83,44.61
SCLK
  Top 0.305: IC5.3 75.55,39.19 76.32,38.42 76.32,35.24 79.18,32.38 79.18,30.8 80.45,29.53 CON9.5 80.45,27.94 80.13,27.62 79.18,27.62 76.32,24.77 IC10.2
SDA  (via drill 0.4)
  Top 0.305: IC5.15 70.29,47.41 v70.29,49.85 70.13,50.01 70.13,50.96 69.02,52.07 69.02,54.29 69.33,54.61 IC8.3 71.24,54.61 71.72,54.13 v71.72,51.59 | v46.95,25.56 46.79,25.4 46.79,19.21 46.63,19.05 46.63,16.19 46,15.56 35.68,15.56 35.23,16.01 BRD1.SDA | v54.41,45.4 54.41,45.09 53.14,43.81 v51.87,43.81 51.71,43.97 45.84,43.97 45.67,44.14 R12.1 45.55,45.2 IC1.7 | v49.49,32.54 49.49,35.72 51.87,38.1 v51.87,40.32
  Bottom 0.305: v54.41,45.4 58.86,49.85 v70.29,49.85 | v46.95,25.56 49.49,28.1 v49.49,32.54 | v51.87,40.32 v51.87,43.81 | CON8.3 80.61,53.02 78.7,51.12 72.19,51.12 v71.72,51.59
SWITCHNODE  (via drill 0.9 pad 1.52)  (1 unrouted)
  Top 0.406: Q5.1 Q5.2 Q5.3 16,24.13 | C8.1 12.5,23.81 12.82,24.13 16,24.13 | 16,24.13 IC3.4
  Bottom 0.813: Q6.MB3 Q6.VIA5
  other vias: 32.03,33.5
  pour Top (isolate 0.254, no thermals): 12.82,31.75 16.31,31.75 16.31,29.53 16.63,29.21 19.17,29.21 19.49,29.53 19.49,33.02 26.16,33.02 26.47,33.34 26.47,39.05 26.79,39.37 32.51,39.37 32.82,39.05 32.82,33.02 26.47,26.67 13.45,26.67 12.82,27.3
T1OSI
  Top 0.305: C18.2 64.87,32.21 X1.2 64.87,34.27 65.5,34.9 IC5.35
T1OSO
  Top 0.305: IC5.32 63.96,38.39 64.25,38.1 64.25,36.83 62.37,34.95 X1.1 62.37,32.21 C19.2
TEMP_EXT1  (via drill 0.4, 0.6)
  Top 0.305: v65.05,41.27 65.05,44.93 66.3,46.18 IC5.20 66.3,48.4 66.95,49.05 C46.2 | v56.79,32.38 56,32.38 48.06,24.45 48.06,18.26 v47.9,18.1 | R34.2 9.96,46.35 10.6,45.72 v10.6,44.77
  Bottom 0.305: v10.6,44.77 11.23,44.13 11.23,40.32 10.91,40.01 10.91,39.37 11.23,39.05 11.23,22.23 17.9,15.56 46,15.56 47.9,17.46 v47.9,18.1 | v56.79,32.38 56.79,36.35 60.13,39.69 62.35,39.69 63.94,41.27 v65.05,41.27
TEMP_EXT2  (via drill 0.4)
  Top 0.305: v64.25,40.32 64.25,45.09 65.5,46.33 IC5.21 65.53,47.42 65.53,49.21 66.16,49.85 C47.2 | v48.54,16.83 48.7,16.99 48.7,24.13 56.16,31.59 57.43,31.59 v57.59,31.75 | v9.64,34.61 9.49,34.76 R35.2
  Bottom 0.305: v9.64,34.61 10.6,33.66 10.6,21.91 17.58,14.92 46.63,14.92 v48.54,16.83 | v57.59,31.75 57.59,36.2 60.44,39.05 62.98,39.05 v64.25,40.32
TEMP_ONBOARD  (via drill 0.4)
  Top 0.305: v71.88,42.23 72.84,43.19 IC5.8 74.51,43.18 75.37,43.18 75.69,43.5 75.69,45.72 76.17,46.2 C45.2 | v56.32,42.86 53.78,42.86 53.46,42.55 50.13,42.55 49.97,42.39 49.17,42.39 48.86,42.7 44.41,42.7 43.94,43.18 R33.2
  Bottom 0.305: v71.88,42.23 69.18,42.23 68.38,43.02 67.27,43.02 66.16,44.13 57.59,44.13 v56.32,42.86
USB+
  Top 0.305: IC5.43 71.9,34.31 71.4,33.81 71.4,24.61 69.02,22.23 69.02,8.09 CON2.DATA+
USB-
  Top 0.305: IC5.42 71.1,34.47 70.78,34.15 70.78,24.94 68.38,22.54 68.38,9.45 CON2.DATA-
USB_SENSE
  Top 0.305: IC5.44 72.7,34.16 72.03,33.5 72.03,24.29 69.65,21.91 69.65,15.24 | 69.65,15.24 69.65,9.53 70.29,8.89 70.29,8.86 CON2.+5V | D4.A 69.65,15.24
VCC  (via drill 0.6, 0.9 pad 1.52)  (3 unrouted)
  Top 0.305: C27.1 R16.2 | R13.1 | IC10.5 79.18,22.23 78.22,21.27 73.14,21.27 72.83,21.59 72.83,23.18 73.14,23.5 IC10.3
  Top 0.406: R12.2 v48.38,45.09 | v48.38,45.09 R11.2 | v48.38,45.09 48.38,46.67 47.11,47.94 IC1.6 45.4,48.09 C1.1 | C29.1 38.26,36.68 C28.1 36.13,36.33 35.68,35.88 35.68,29.21 36,28.89 36,27.62 35.68,27.3 v35.68,21.91 | C14.1 67.1,33.52 IC5.37 67.11,35.8 67.11,36.83 v68.7,38.42 69.02,38.73 70.92,38.73 70.92,40.16 73.15,42.39 IC5.7 C13.1 78.69,42.39 79.5,41.59 R13.1 79.66,38.26 80.45,38.26 80.92,37.78 CON11.2 | v52.35,45.56 53.46,46.67 53.46,47.31 v54.41,48.26 55.37,47.31 55.37,45.09 57.75,42.7 v59.17,42.7 59.8,42.08 C16.1 60.61,41.91 61.72,41.91 62.03,41.59 IC5.28 | C26.1 67.3,56.16 IC8.4 v58.86,54.61 | C27.1 46.48,36.83 v46.48,40.96 44.41,40.96 43.93,41.43 40.6,41.43 40.28,41.12 40.28,40.68 L2.2E | IC9.8 40.12,36.54 C29.1 | C29.1 39.98,36.68 L2.2C | R13.1 78.54,38.42 78.22,38.1 78.22,36.2 CON9.3 84.26,30.16 84.26,22.54 83.78,22.06 C30.1 82.82,22.23 IC10.5 IC10.6
  Bottom 0.406: v46.48,40.96 48.38,42.86 v48.38,45.09 51.87,45.09 v52.35,45.56 | v35.68,21.91 33.46,19.68 30.92,19.68 30.15,18.92 BRD1.VCC | v68.7,38.42 68.38,38.73 68.38,39.85 65.37,42.86 59.33,42.86 v59.17,42.7 | v58.86,54.61 58.86,52.7 v54.41,48.26 | CON8.1 83.62,47.94 84.26,47.31 84.26,38.42 83.62,37.78 CON11.2
VCC_HIGH  (via drill 0.4, 0.6)
  Top 0.305: 11.87,43.81 11.87,52.86 11.39,53.34 8.06,53.34 7.42,53.98 7.42,58.42 7.74,58.73 Q1.1 | 11.87,43.81 v11.87,39.69 | 11.87,43.81 CON4.1 1.07,43.81 0.76,43.5 0.76,36.51 1.07,36.2 CON5.1 | Q7.1 38.9,51.16 37.42,49.68 C23.2 | v55.52,43.66 53.78,43.66 53.14,43.02 51.55,43.02 51.4,43.18 v49.65,43.18 49.49,43.34 45.05,43.34 43.94,44.45 39.17,44.45 38.85,44.77 38.85,45.07 IC7.4 IC7.5 | v58.7,46.83 58.54,46.99 58.54,49.21 59.17,49.85 C17.1 | Q8.1 49.01,38.1 | 49.01,38.1 48.7,38.42 v48.7,41.12 | 48.7,30.8 48.7,37.79 49.01,38.1 | 48.7,30.8 47.43,29.53 44.89,29.53 42.98,27.62 42.98,22.54 42.35,21.91 39.49,21.91 38.54,20.95 31.39,20.95 31.23,21.11 v27.58,21.11 | 48.7,30.8 v53.78,35.88 | IC6.1 59.38,50.44 C17.1 | 59.33,50.63 C17.1 | v22.34,16.51 23.61,17.78 24.25,17.78 v25.2,18.73 | IC5.36 66.3,34.43 65.84,33.97 65.84,29.53 65.53,29.21 60.92,29.21 59.33,30.8 v57.27,30.8
  Top 0.406: IC7.5 37.52,46.57 C23.2
  Bottom 0.305: v11.87,39.69 11.87,22.54 18.22,16.19 22.03,16.19 v22.34,16.51 | v55.52,43.66 v58.7,46.83 | v48.7,41.12 48.7,42.23 v49.65,43.18 | v57.27,30.8 56,32.07 56,33.66 v53.78,35.88 | v27.58,21.11 v25.2,18.73
VIN
  Top 0.305: IC2.5 15.04,63.18 R3.2
  Top 0.813: C4.+ C5.+
  Bottom 0.813: Q5.VIA5 Q5.MB3
  pour Top (isolate 0.203, no thermals): 12.5,32.38 12.5,61.28 13.45,62.23 13.45,62.55 17.58,62.55 17.58,32.38
VIN_SENSE  (via drill 0.4)
  Top 0.305: v22.34,75.09 21.39,75.09 21.23,74.93 13.45,74.93 11.23,72.71 11.23,70.17 10.91,69.85 9.33,69.85 8.69,69.22 8.69,66.67 7.11,65.09 7.11,62.23 9.64,59.69 9.64,57.15 9.33,56.84 Q1.2 8.84,56.63 R2.2 | v39.01,57.63 43.78,57.63 44.89,56.52 48.38,56.52 49.02,55.88 49.02,53.02 IC1.13 52.98,53.02 C2.1
  Bottom 0.305: v22.34,75.09 22.5,74.93 27.9,74.93 28.38,74.45 28.38,66.99 28.7,66.67 36.63,66.67 37.27,66.04 37.27,58.42 38.06,57.63 v39.01,57.63
VOUT  (via drill 0.4, 0.6)  (1 unrouted)
  Top 0.305: R7.1 30.28,63.34 30.51,63.56 IC4.4
  Top 0.406: Q4.2 29.33,26.98 29.01,26.67 29.01,25.08 28.06,24.13 28.06,23.34 R4.2 28.06,23.01 28.06,21.91 | 34.73,28.26 34.73,22.23 34.09,21.59 31.87,21.59 31.55,21.91 28.06,21.91 | v35.05,28.26 34.73,28.26 | 34.73,28.26 34.73,39.37 v35.05,39.69 | 31.84,45.72 32.82,45.72 32.82,45.4 32.98,45.24 34.25,45.24 v34.41,45.09 | v23.77,18.73 23.46,18.73 20.76,16.03 16,16.03 13.61,18.41 9.64,18.41 7.42,20.64 D3.C 6.33,23.95 5.84,24.45 5.84,25.4 4.56,26.67 CON7.1 | v36.95,28.26 41.08,28.26 41.84,29.02 C25.1 41.84,32.19 C24.1 | v26.31,21.27 26.95,21.91 28.06,21.91 | IC9.1 41.69,32.41 C24.1 | IC9.3 42.99,32.71 42.66,32.38 42.04,32.38 C24.1
  Bottom 0.406: v35.05,39.69 35.05,40.01 34.41,40.64 v34.41,45.09 | v23.77,18.73 v26.31,21.27 | v35.05,28.26 v36.95,28.26
  pour Top (isolate 0.254, no thermals): 26.47,45.09 26.47,51.75 27.74,51.75 27.74,62.55 31.55,62.55 31.55,57.47 33.14,55.88 33.14,45.09
VOUT_SENSE
  Top 0.305: Q7.2 40.61,54.29 R9.2 40.91,54.29 43.77,54.29 C12.1 43.77,54.29 IC1.1
VREF
  Top 0.305: IC6.2 64.06,50.44 C22.1 64.25,49.85 64.7,49.4 IC5.22

### Text on the board
tPlace: +Pan- | -Bat+ | +Out1- | +Out2- | +Out3- | +Out4- | soldernerd.com | GND | Temp | 3V3 | I2C | 1 | Temperature | ICSP | 2 | - | SPI | Fan | + | User Interface | Solar Charger | Rev E
bPlace: 75 Watt MPPT Solar Charger | Lukas Fässler | GND | SDA | soldernerd.com | I2C | SCL | January 2018 - Rev E | VCC | PGC | PGD | ICSP | GND | VCC | ~MC | SPI | MOSI | MISO | VCC | ~SS2 | SCLK | GND | ~EN | VCC | SCL | SDA | GND | PB | A | B | User Interface